# Altium schematic sheet MAIN.SchDoc: HQ_RPI_T113_V04
size 840 x 594 mm; Date: 2024.11.4; DrawnBy: Zegnfh; Page Create Date: March  8, 1995; Date1: 2024.11.4; Page Number: 1; PageTitle: MAIN; Page Size: NC; Comment: Title_ElecLab; Page Count: 1; Designer: Yukiyu; RevCode: A3; DsnPath: F:\share\Embed\HQ_RPI_T113_V04\HQ_RPI_T113_V04_162.DSN; SchematicName: SCHEMATIC1; PageName: MAIN; PageSize: A1; TopSchematic: True
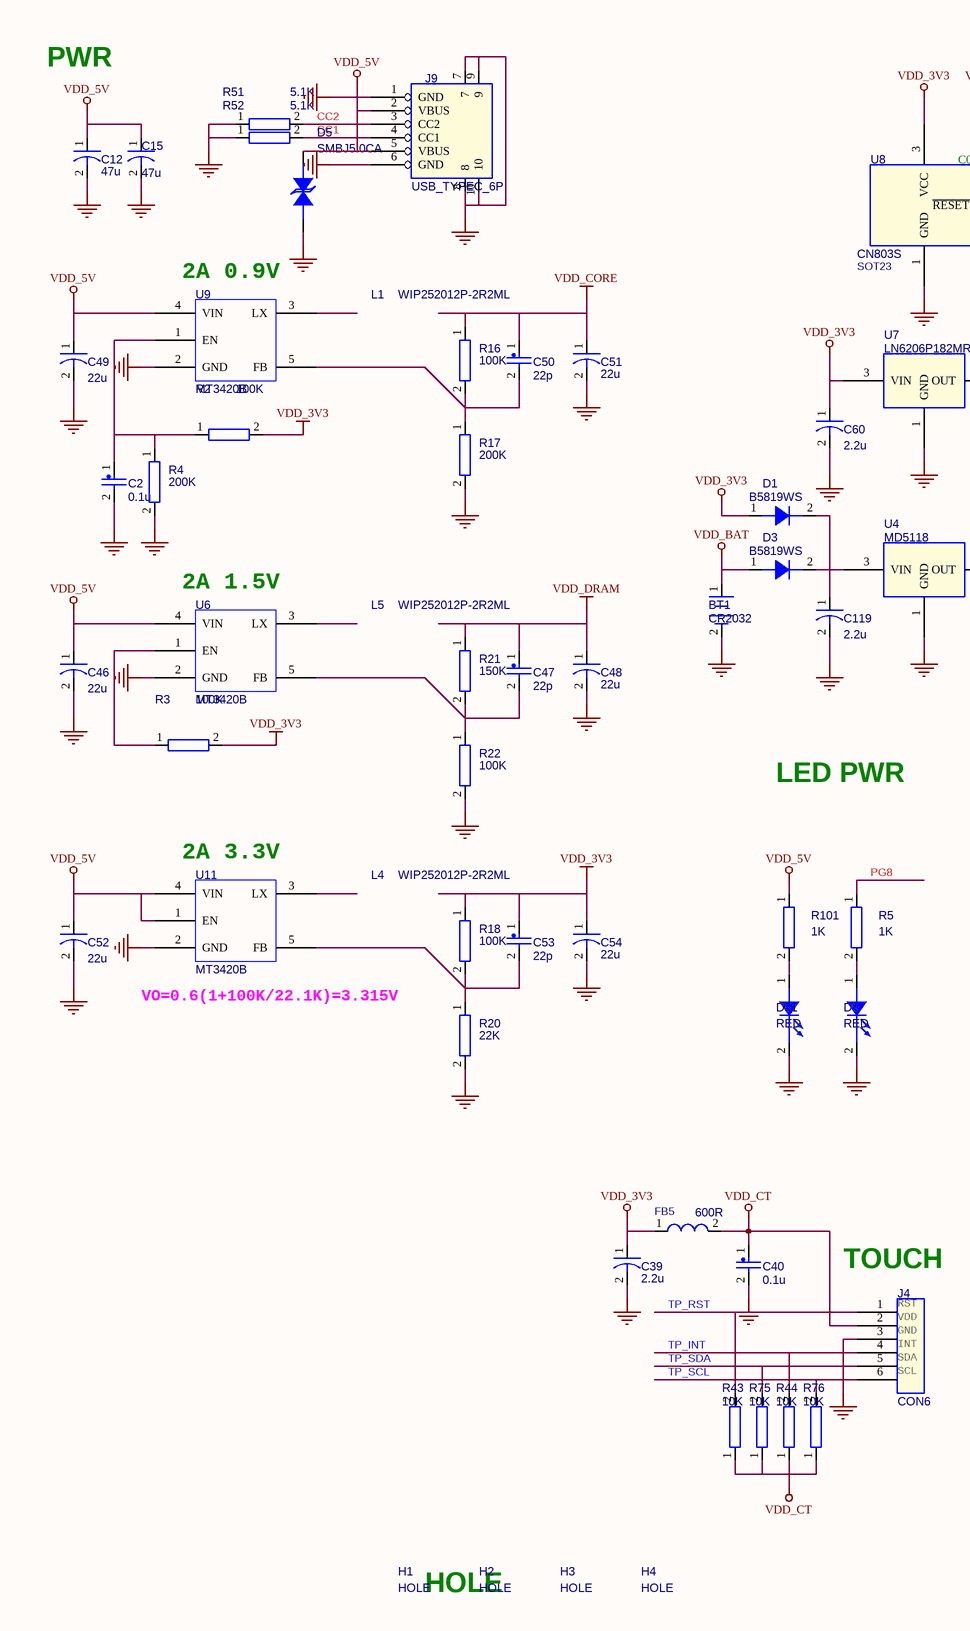
[diagram p0: MAIN.SchDoc, top left]
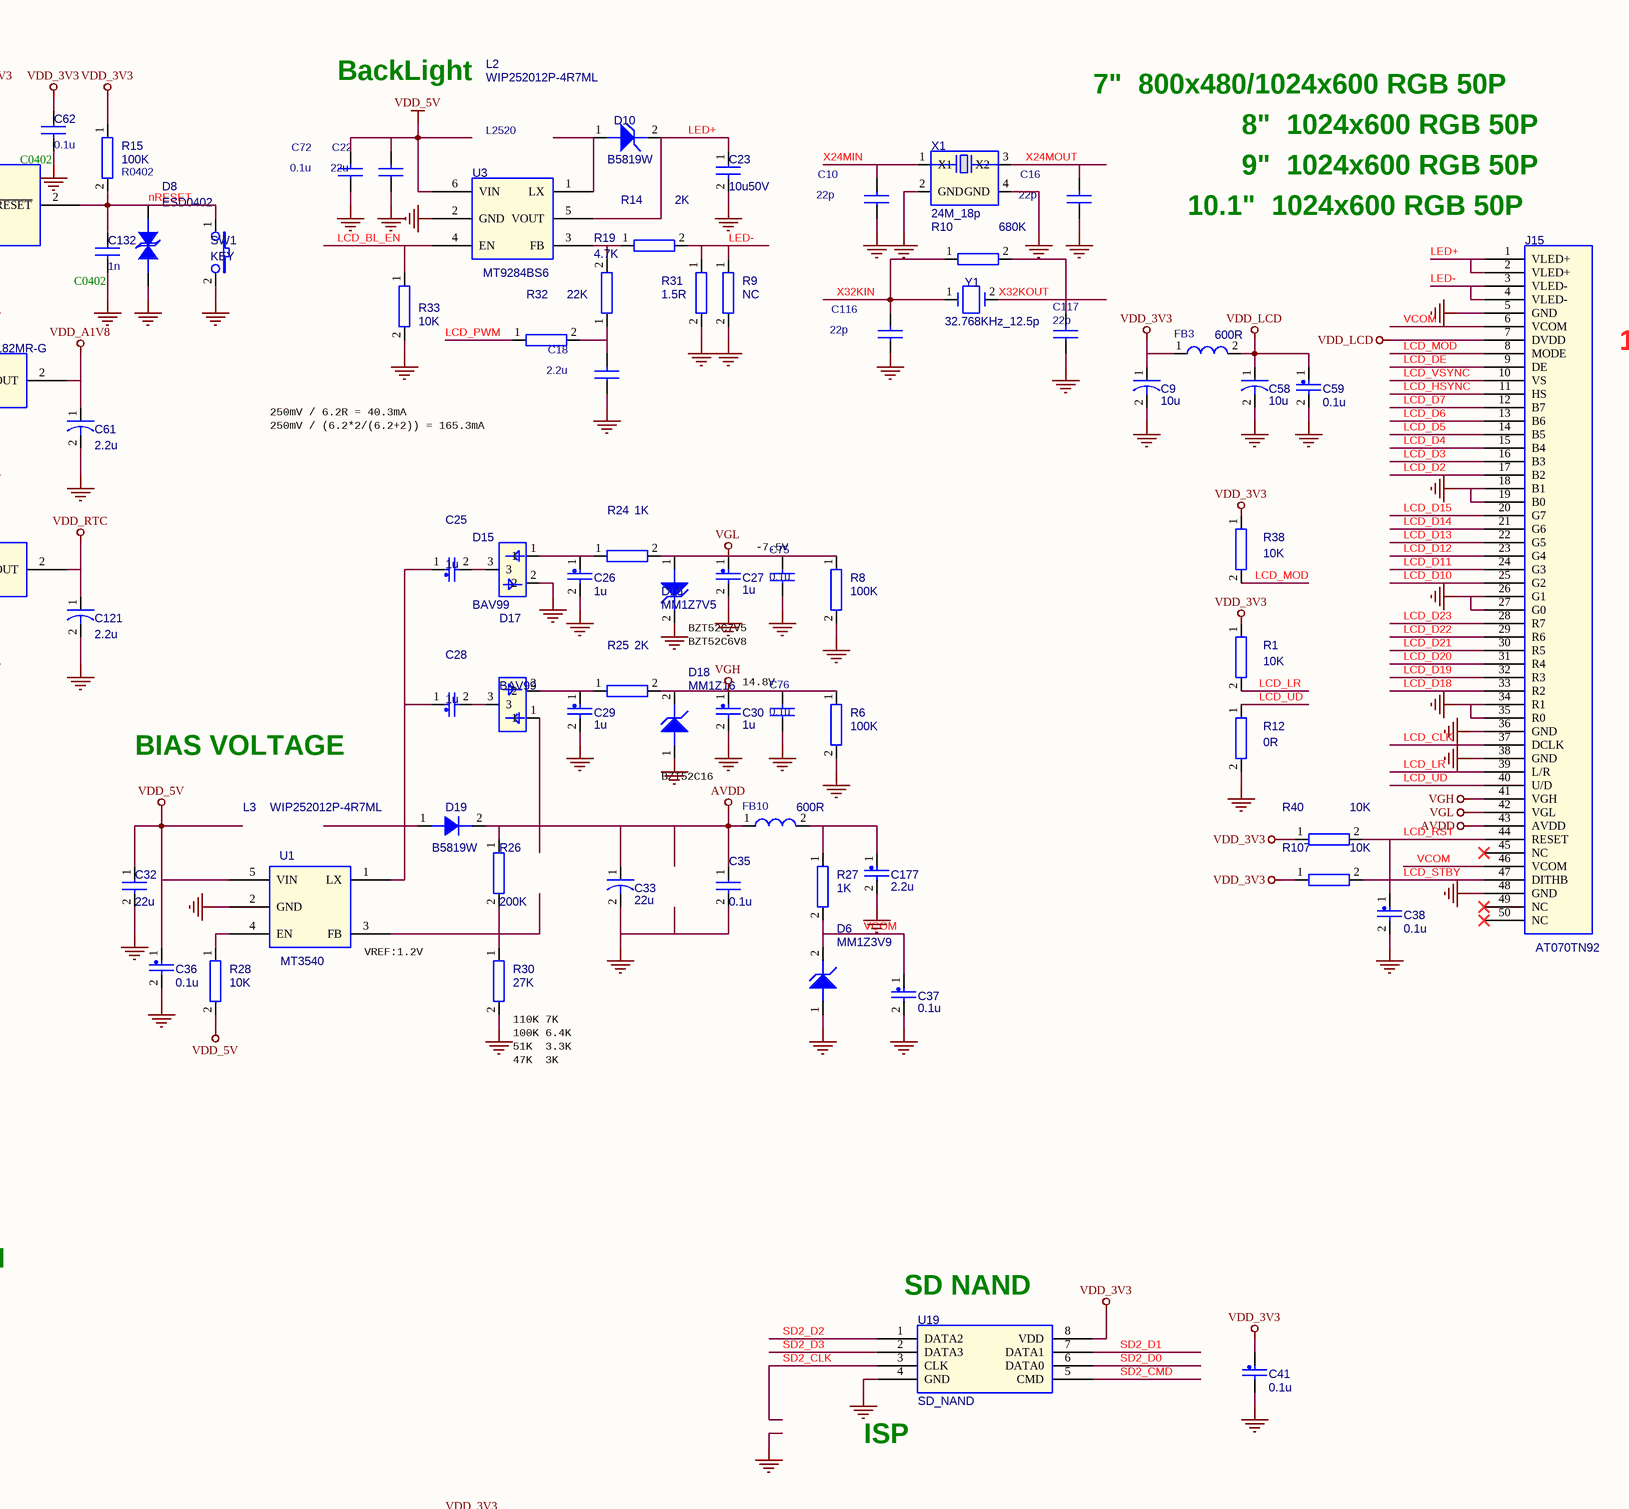
[diagram p1: MAIN.SchDoc, top middle]
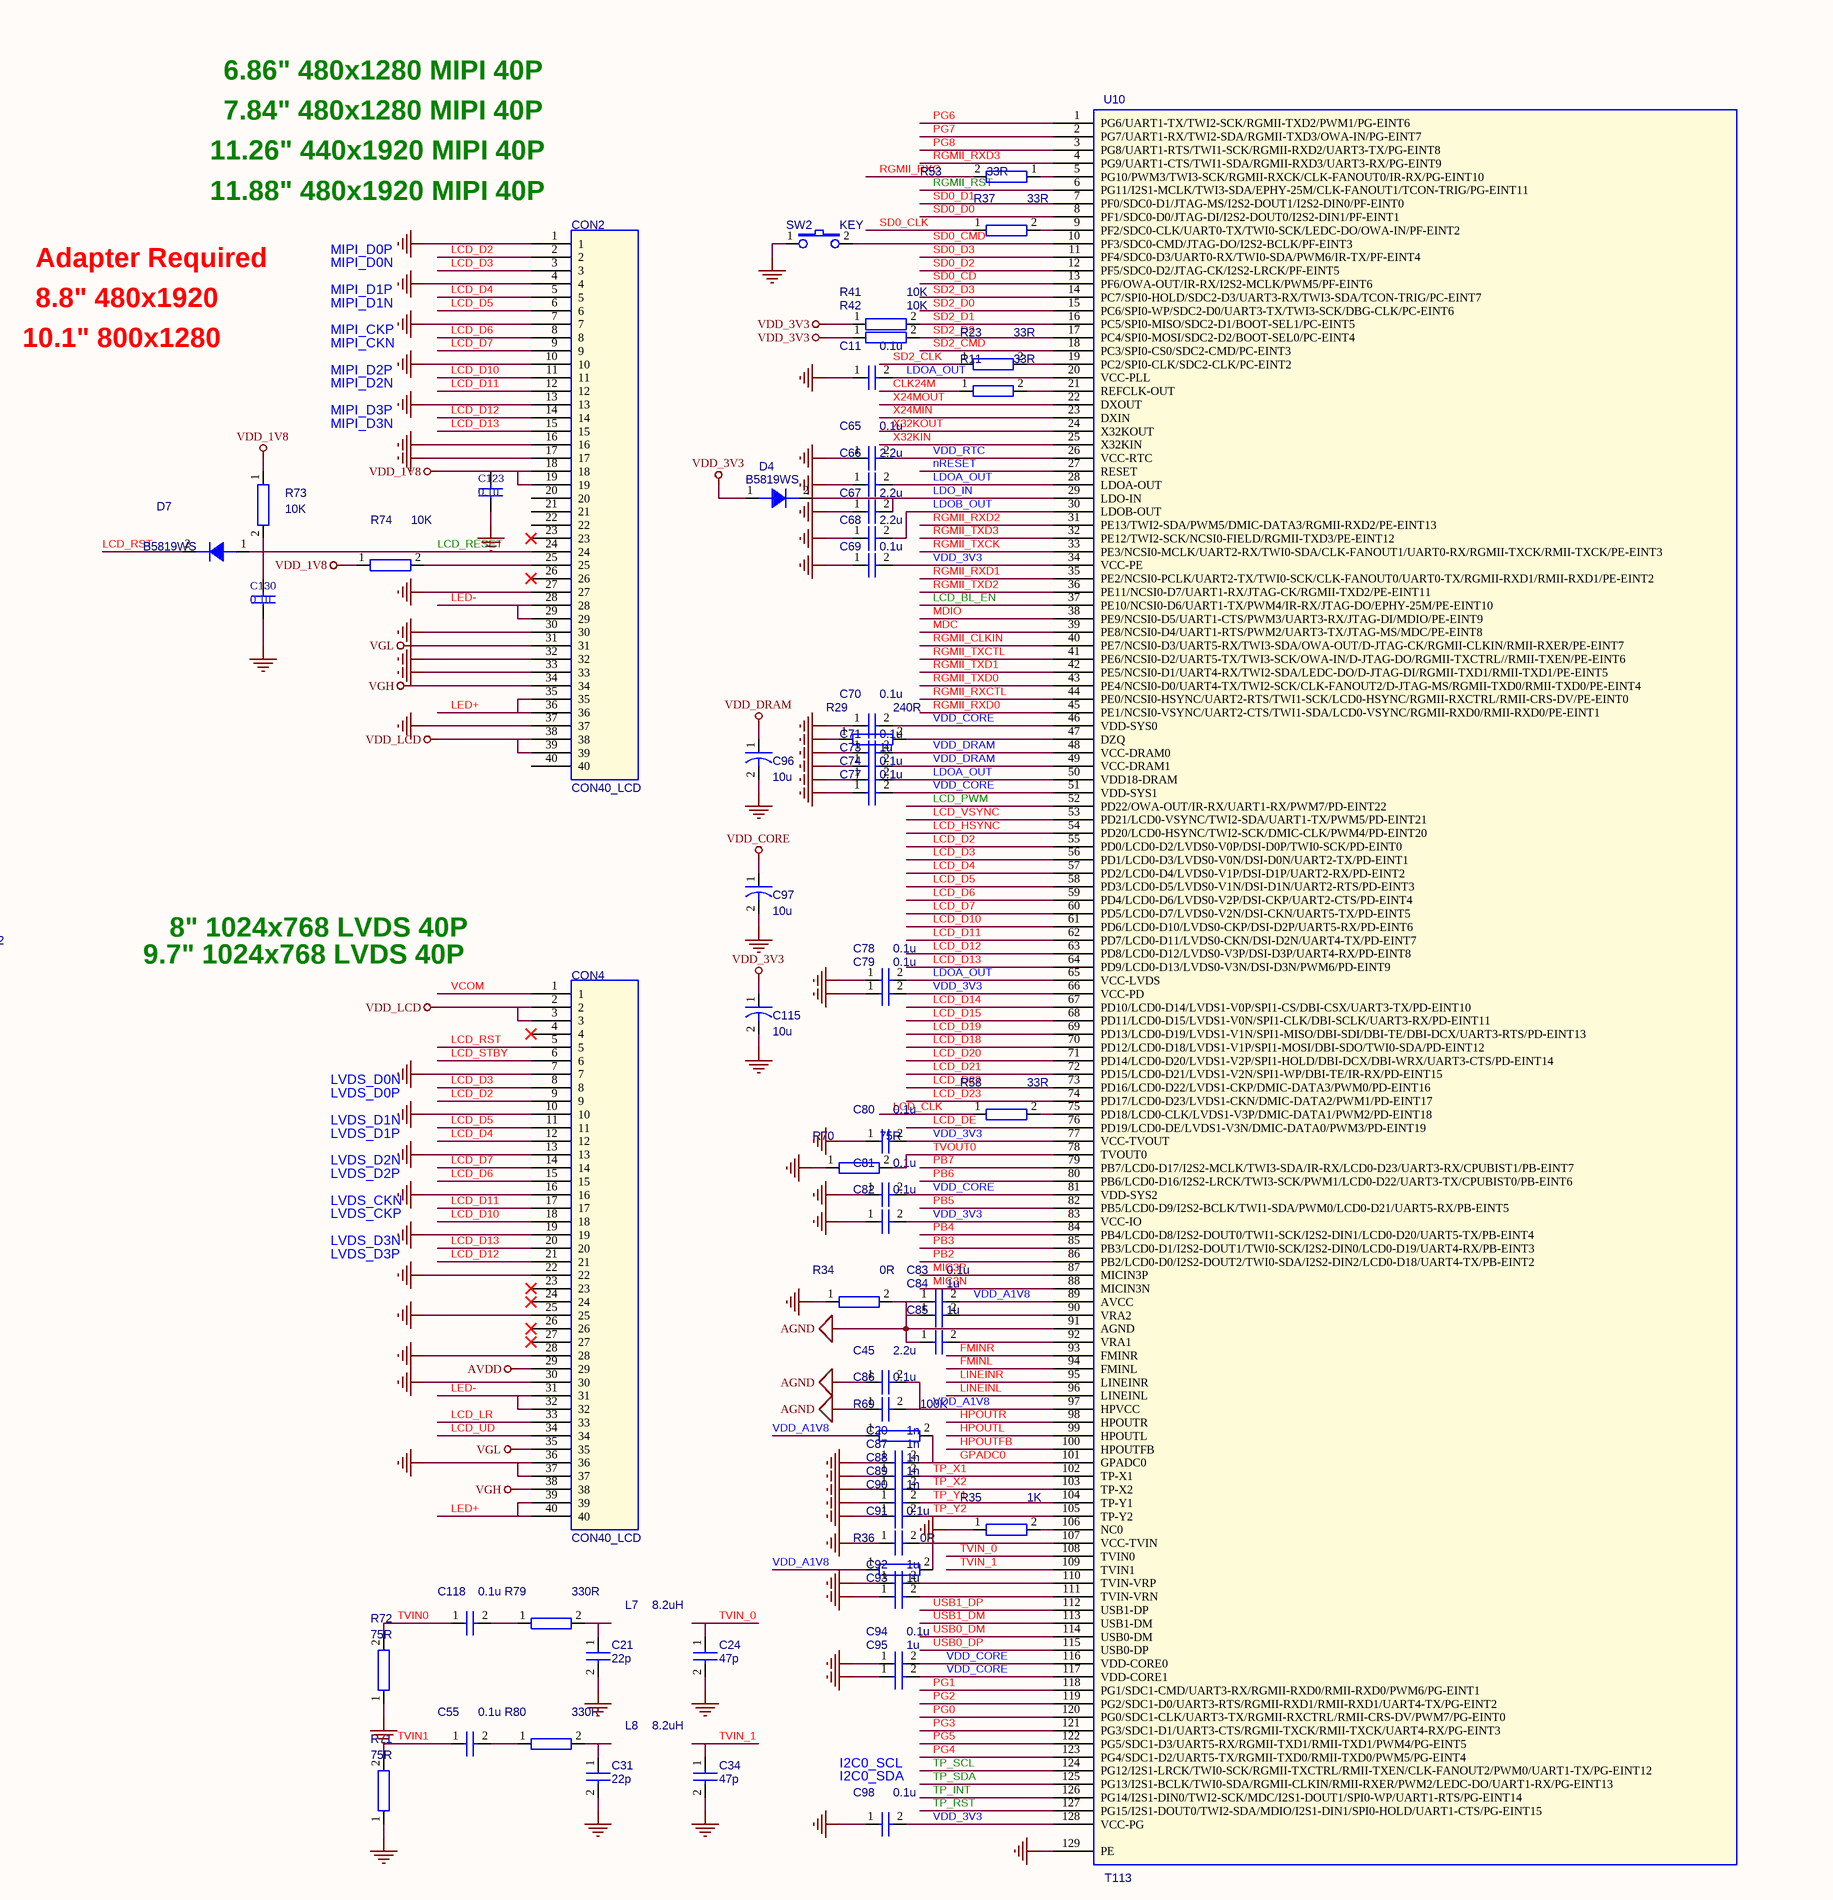
[diagram p2: MAIN.SchDoc, top right]
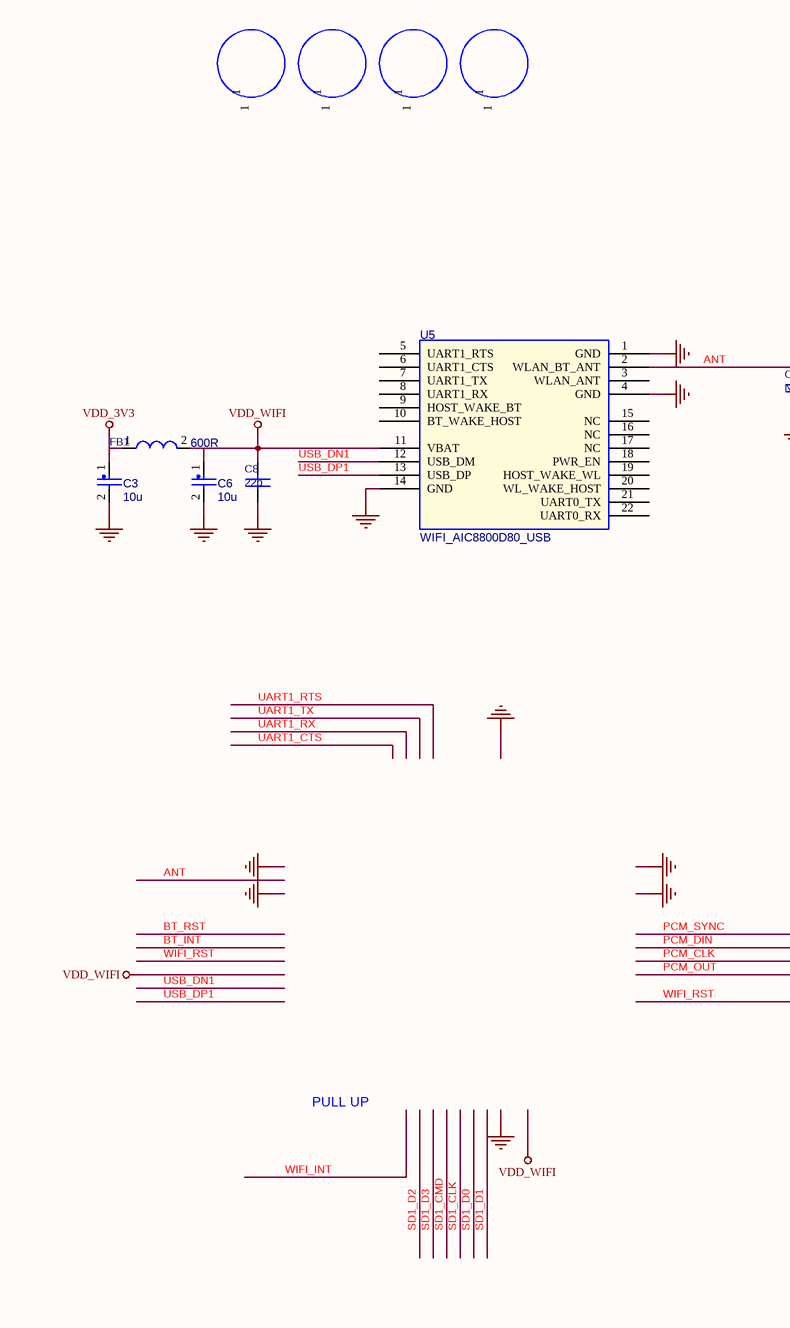
[diagram p3: MAIN.SchDoc, bottom left]
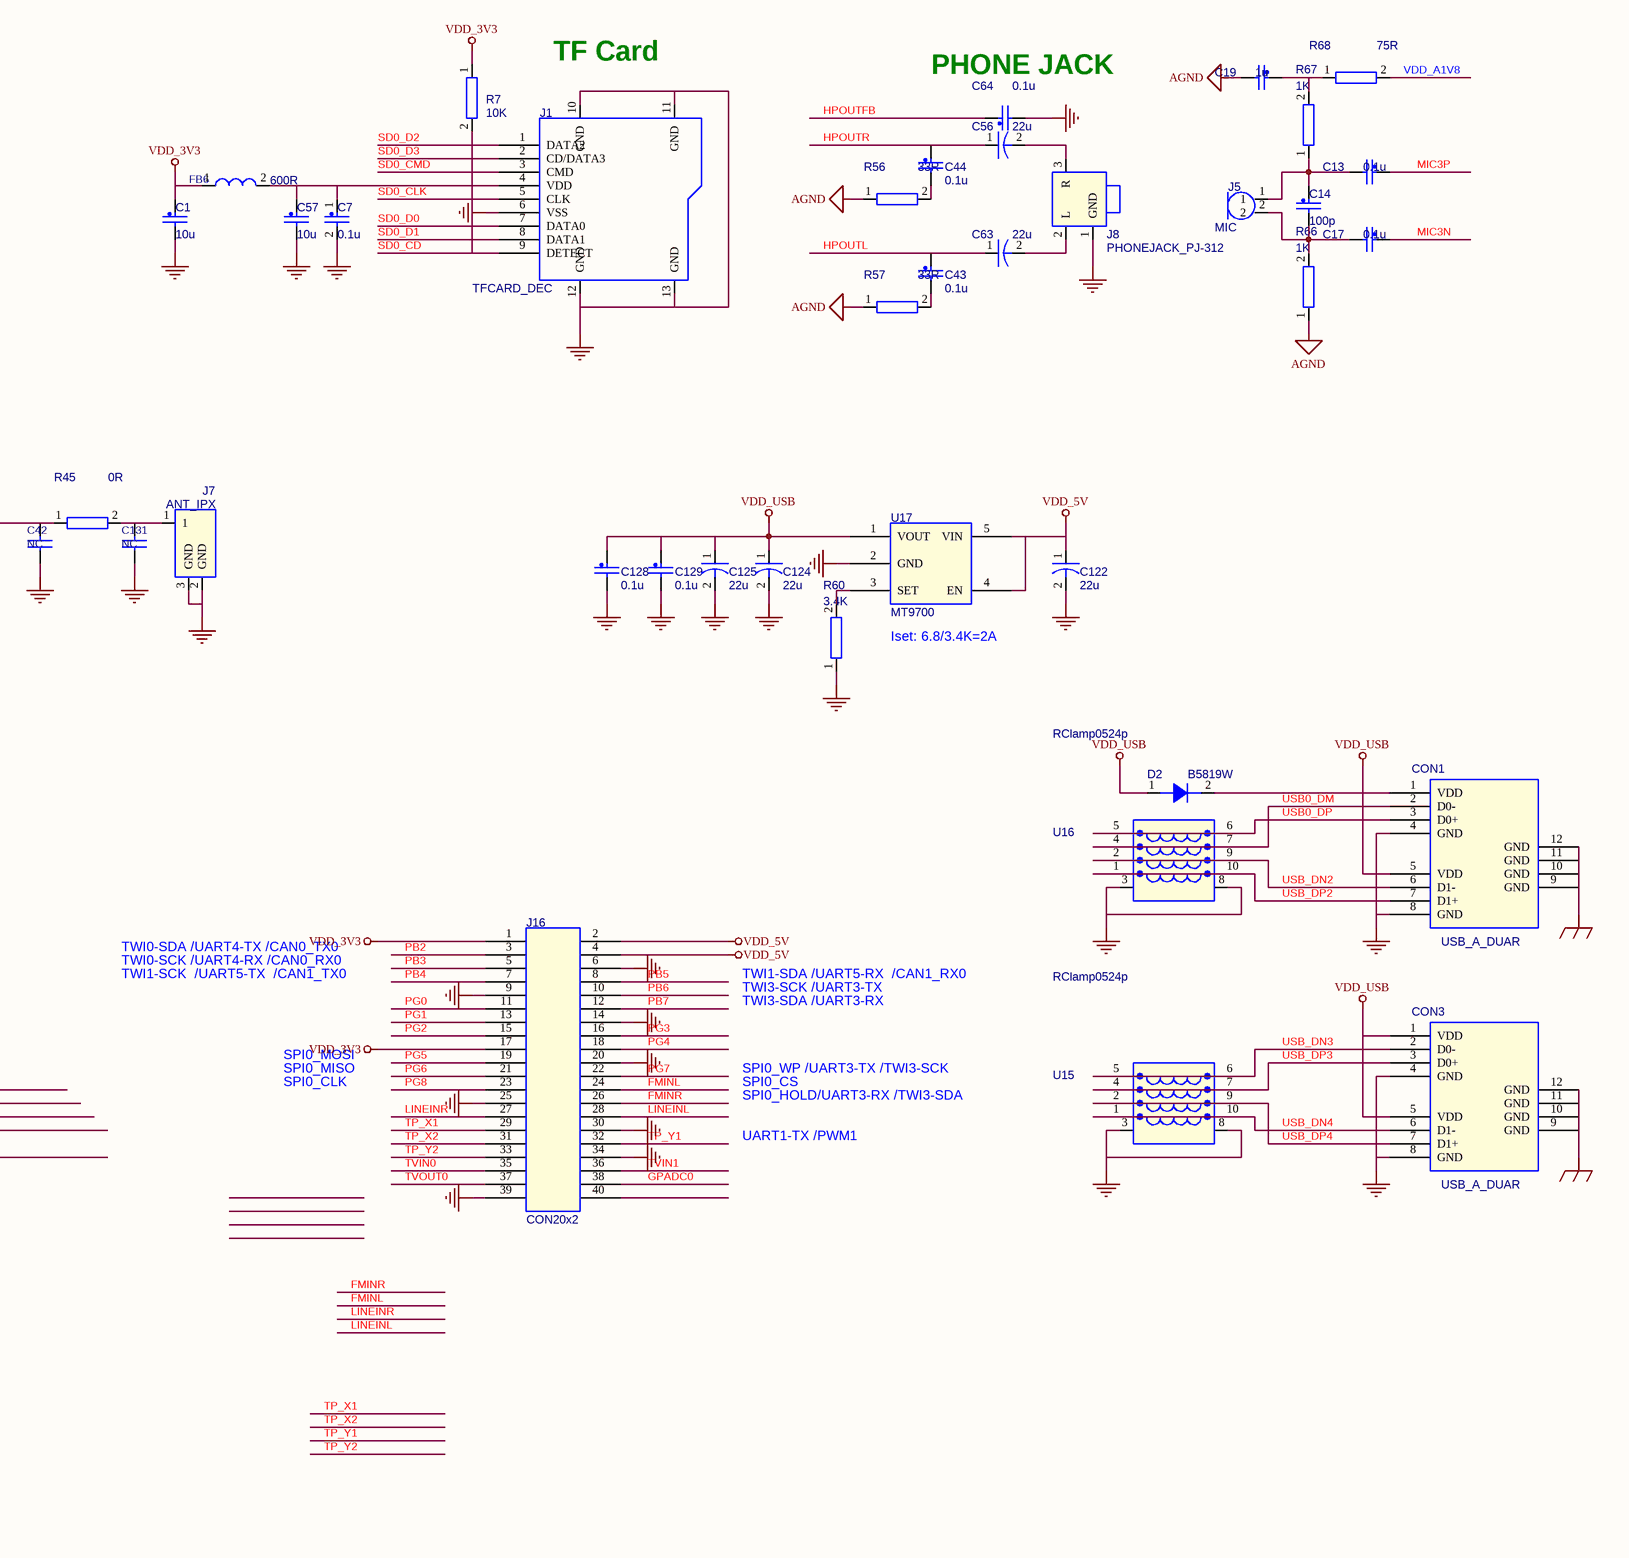
[diagram p4: MAIN.SchDoc, bottom middle]
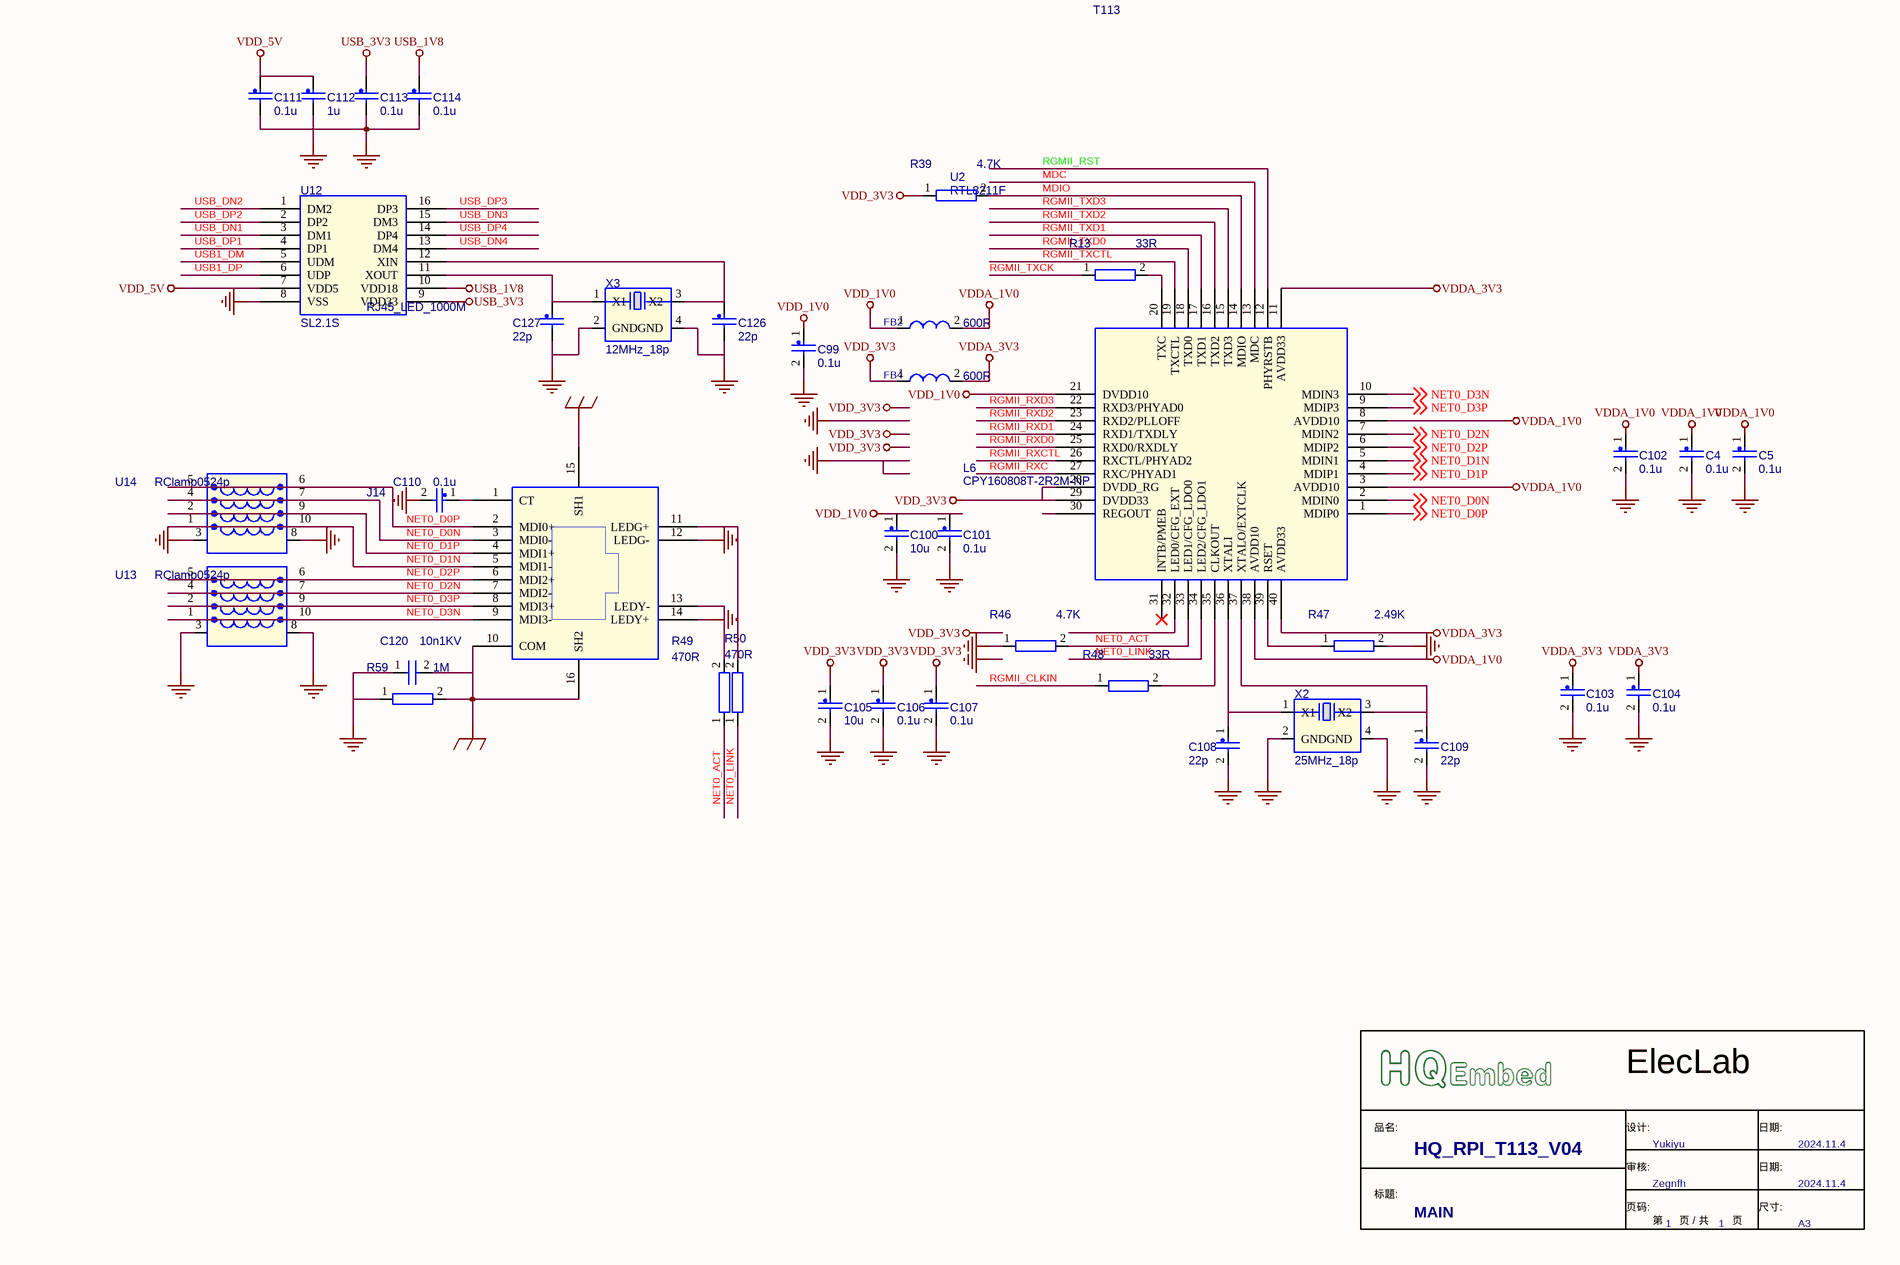
[diagram p5: MAIN.SchDoc, bottom right]

## Parts
*  Date1: 2024.11.4  RevCode: A3  Title: HQ_RPI_T113_V04  Page Number: 1  PageTitle: MAIN  Designer: Yukiyu  DrawnBy: Zegnfh  (hidden comment: Title_ElecLab)  (graphical)
BT1  CR2032  [CON_CR2032]
C1  10u  [C0603]
C2  0.1u  [C0603]
C3  10u  [C0603]
C4  0.1u  [C0603]
C5  0.1u  [C0603]
C6  10u  [C0603]
C7  0.1u  [C0603]
C8  22p  [C0402]
C9  10u  [C1206]
C10  22p  [C0402]
C11  0.1u  [C0603]
C12  47u  [C1206]
C13  0.1u  [C0402]
C14  100p  [C0402]
C15  47u  [C1206]
C16  22p  [C0402]
C17  0.1u  [C0402]
C18  2.2u  [C0402]
C19  1u  [C0402]
C20  1n  [C0603]
C21  22p  [C0603]
C22  22u  [C0805]
C23  10u50V  [C1206]
C24  47p  [C0603]
C25  1u  [C0603]
C26  1u  [C0603]
C27  1u  [C0603]
C28  1u  [C0603]
C29  1u  [C0603]
C30  1u  [C0603]
C31  22p  [C0603]
C32  22u  [C0805]
C33  22u  [C1206]
C34  47p  [C0603]
C35  0.1u  [RC_C0603]
C36  0.1u  [C0603]
C37  0.1u  [C0603]
C38  0.1u  [C0603]
C39  2.2u  [C1206]
C40  0.1u  [C0603]
C41  0.1u  [C0402]
C42  NC  [C0402]
C43  0.1u  [C0402]
C44  0.1u  [C0402]
C45  2.2u  [C0603]
C46  22u  [C1206]
C47  22p  [C0603]
C48  22u  [C1206]
C49  22u  [C1206]
C50  22p  [C0603]
C51  22u  [C1206]
C52  22u  [C1206]
C53  22p  [C0603]
C54  22u  [C1206]
C55  0.1u  [C0603]
C56  22u  [C1206]
C57  10u  [C0603]
C58  10u  [C1206]
C59  0.1u  [C0603]
C60  2.2u  [C1206]
C61  2.2u  [C1206]
C62  0.1u  [C0402]
C63  22u  [C1206]
C64  0.1u  [C0402]
C65  0.1u  [C0603]
C66  2.2u  [C0603]
C67  2.2u  [C0603]
C68  2.2u  [C0603]
C69  0.1u  [C0603]
C70  0.1u  [C0603]
C71  0.1u  [C0603]
C72  0.1u  [C0402]
C73  1u  [C0603]
C74  0.1u  [C0603]
C75  0.1u  [C0402]
C76  0.1u  [C0402]
C77  0.1u  [C0603]
C78  0.1u  [C0603]
C79  0.1u  [C0603]
C80  0.1u  [C0603]
C81  0.1u  [C0603]
C82  0.1u  [C0603]
C83  0.1u  [C0603]
C84  1u  [C0603]
C85  1u  [C0603]
C86  0.1u  [C0603]
C87  1n  [C0603]
C88  1n  [C0603]
C89  1n  [C0603]
C90  1n  [C0603]
C91  0.1u  [C0603]
C92  1u  [C0603]
C93  1u  [C0603]
C94  0.1u  [C0603]
C95  1u  [C0603]
C96  10u  [C1206]
C97  10u  [C1206]
C98  0.1u  [C0603]
C99  0.1u  [C0603]
C100  10u  [C0603]
C101  0.1u  [C0603]
C102  0.1u  [C0603]
C103  0.1u  [C0603]
C104  0.1u  [C0603]
C105  10u  [C0603]
C106  0.1u  [C0603]
C107  0.1u  [C0603]
C108  22p  [C0603]
C109  22p  [C0603]
C110  0.1u  [C0603]
C111  0.1u  [C0402]
C112  1u  [C0402]
C113  0.1u  [C0402]
C114  0.1u  [C0402]
C115  10u  [C1206]
C116  22p  [C0402]
C117  22p  [C0402]
C118  0.1u  [C0603]
C119  2.2u  [C1206]
C120  10n1KV  [C0603]
C121  2.2u  [C1206]
C122  22u  [C1206]
C123  0.1u  [C0402]
C124  22u  [C1206]
C125  22u  [C1206]
C126  22p  [C0402]
C127  22p  [C0402]
C128  0.1u  [C0402]
C129  0.1u  [C0402]
C130  0.1u  [C0402]
C131  NC  [C0402]
C132  1n  [C0402]
C177  2.2u  [C0603]
CON1  USB_A_DUAR  [USB_A_DUAL]
CON2  CON40_LCD  [LCD-FPC-40-0P5-90-REV]
CON3  USB_A_DUAR  [USB_A_DUAL]
CON4  CON40_LCD  [LCD-FPC-40-0P5-90]
D1  B5819WS  [D0805]
D2  B5819W  [DIODE]
D3  B5819WS  [D0805]
D4  B5819WS  [D0805]
D5  SMBJ5.0CA  [SMB]
D6  MM1Z3V9  [SOD123]
D7  B5819WS  [D0805]
D8  ESD0402  [SMB]
D9  RED  [LED0603]
D10  B5819W  [SOD123]
D15  BAV99  [SOT23]
D16  MM1Z7V5  [SOD123]
D17  BAV99  [SOT23]
D18  MM1Z16  [SOD123]
D19  B5819W  [DIODE]
D51  RED  [LED0603]
FB1  600R  [L0805]
FB2  600R  [L0805]
FB3  600R  [L0805]
FB4  600R  [L0805]
FB5  600R  [L0805]
FB6  600R  [L0805]
FB10  600R  [L0805]
H1  HOLE  [HOLE-260/125]
H2  HOLE  [HOLE-260/125]
H3  HOLE  [HOLE-260/125]
H4  HOLE  [HOLE-260/125]
J1  TFCARD_DEC  [TFCARD_DEC]
J4  CON6  [LCD-FPC-6-0P5-90-REV]
J5  MIC  [MIC_01]
J7  ANT_IPX  [ANT_IPX]
J8  PHONEJACK_PJ-312  [PHONEJACK_PJ-312_DIP]
J9  USB_TYPEC_6P  [USB_TYPEC_6P]
J14  RJ45_LED_1000M  [HR911130A]
J15  AT070TN92  [LCD-FPC-50-0P5-90]
J16  CON20x2  [CON20X2.54MM]
L1  WIP252012P-2R2ML  [L4X4]
L2  WIP252012P-4R7ML  PCB Footprint: L2520  [L4X4]
L3  WIP252012P-4R7ML  [L1206]
L4  WIP252012P-2R2ML  [L4X4]
L5  WIP252012P-2R2ML  [L4X4]
L6  CPY160808T-2R2M-NP  [L4X4]
L7  8.2uH  [L4X4]
L8  8.2uH  [L4X4]
R1  10K  [R0603]
R2  100K  [R0603]
R3  100K  [R0603]
R4  200K  [R0603]
R5  1K  [R0603]
R6  100K  [R0603]
R7  10K  [R0402]
R8  100K  [R0603]
R9  NC  [R0603]
R10  680K  [R0603]
R11  33R  [R0603]
R12  0R  [R0603]
R13  33R  [R0603]
R14  2K  [R0603]
R15  100K  PCB Footprint: R0402  [R0603]
R16  100K  [R0603]
R17  200K  [R0603]
R18  100K  [R0603]
R19  4.7K  [R0603]
R20  22K  [R0603]
R21  150K  [R0603]
R22  100K  [R0603]
R23  33R  [R0603]
R24  1K  [R0603]
R25  2K  [R0603]
R26  200K  [R0603]
R27  1K  [R0603]
R28  10K  [R0603]
R29  240R  [R0603]
R30  27K  [R0603]
R31  1.5R  [R0603]
R32  22K  [R0603]
R33  10K  [R0603]
R34  0R  [R0603]
R35  1K  [R0603]
R36  0R  [R0603]
R37  33R  [R0603]
R38  10K  [R0603]
R39  4.7K  [R0603]
R40  10K  [R0603]
R41  10K  [R0603]
R42  10K  [R0603]
R43  10K  [R0603]
R44  10K  [R0603]
R45  0R  [R0603]
R46  4.7K  [R0603]
R47  2.49K  [R0603]
R48  33R  [R0603]
R49  470R  [R0603]
R50  470R  [R0603]
R51  5.1K  [R0603]
R52  5.1K  [R0603]
R53  33R  [R0603]
R56  33R  [R0603]
R57  33R  [R0603]
R58  33R  [R0603]
R59  1M  [R0603]
R60  3.4K  [R0603]
R66  1K  [R0603]
R67  1K  [R0603]
R68  75R  [R0603]
R69  100K  [R0603]
R70  75R  [R0603]
R71  75R  [R0603]
R72  75R  [R0603]
R73  10K  [R0603]
R74  10K  [R0603]
R75  10K  [R0603]
R76  10K  [R0603]
R79  330R  [R0603]
R80  330R  [R0603]
R101  1K  [R0603]
R107  10K  [R0603]
SW1  KEY  [SW6X6]
SW2  KEY  [SW6X6]
U1  MT3540  [SOT23-5]
U2  RTL8211F  [QFN40_GNDPAD]
U3  MT9284BS6  [SOT23-6]
U4  MD5118  [SOT23]
U5  WIFI_AIC8800D80_USB  [WIFI_AIC8800D80_USB]
U6  MT3420B  [SOT23-5]
U7  LN6206P182MR-G  [SOT23]
U8  CN803S  [SOT23]
U9  MT3420B  [SOT23-5]
U10  T113  [LQFP128_0P4_16X16_EP]
U11  MT3420B  [SOT23-5]
U12  SL2.1S  [SSOP16]
U13  RClamp0524p  [SPE6V8UD]
U14  RClamp0524p  [SPE6V8UD]
U15  RClamp0524p  [SPE6V8UD]
U16  RClamp0524p  [SPE6V8UD]
U17  MT9700  [SOT23-5]
U19  SD_NAND  [TF_SMD]
X1  24M_18p  [XTAL_SMD_6035]
X2  25MHz_18p  [XTAL_SMD_6035]
X3  12MHz_18p  [XTAL_SMD_6035]
Y1  32.768KHz_12.5p  [XTAL_3]

## Nets
AGND: C19.2 C45.1 C83.1 C84.1 C85.1 C86.1 R34.2 R56.1 R57.1 R66.1 U10.91(AGND)
AVDD: C33.1 C35.1 CON4.29 D17.1 D19.2(K) FB10.1 J15.43(AVDD) R26.1
GND: BT1.2(-) C1.2 C2.2 C3.2 C4.2 C5.2 C6.2 C7.2 C8.1 C9.2 C10.1 C11.1 C12.2 C15.2 C16.1 C18.1 C20.1 C21.2 C22.1 C23.2 C24.2 C26.2 C27.2 C29.2 C30.2 C31.2 C32.2 C33.2 C34.2 C35.2 C36.2 C37.2 C38.2 C39.2 C40.2 C41.2 C42.1 C46.2 C48.2 C49.2 C51.2 C52.2 C54.2 C57.2 C58.2 C59.2 C60.2 C61.2 C62.2 C64.2 C65.1 C66.1 C67.1 C68.1 C69.1 C70.1 C71.1 C72.1 C73.1 C74.1 C75.1 C76.1 C77.1 C78.1 C79.1 C80.1 C81.1 C82.1 C87.1 C88.1 C89.1 C90.1 C91.1 C92.1 C93.1 C94.1 C95.1 C96.2 C97.2 C98.1 C99.2 C100.2 C101.2 C102.2 C103.2 C104.2 C105.2 C106.2 C107.2 C108.2 C109.2 C110.2 C111.2 C112.2 C113.2 C114.2 C115.2 C116.1 C117.1 C119.2 C120.1 C121.2 C122.2 C123.1 C124.2 C125.2 C126.2 C127.2 C128.2 C129.2 C130.1 C131.1 C132.2 C177.2 CON1.4(GND) CON1.8(GND) CON2.1 CON2.4 CON2.7 CON2.10 CON2.13 CON2.16 CON2.17 CON2.27 CON2.30 CON2.32 CON2.33 CON2.37 CON3.4(GND) CON3.8(GND) CON4.7 CON4.10 CON4.13 CON4.16 CON4.19 CON4.22 CON4.25 CON4.28 CON4.30 CON4.36 CON4.37 D5.1(ANODE) D6.1(ANODE) D8.1(ANODE) D9.2(CATHODE) D15.2 D16.2(CATHODE) D18.1(ANODE) D51.2(CATHODE) J1.6(VSS) J1.10(GND) J1.11(GND) J1.12(GND) J1.13(GND) J4.3 J7.2(GND) J7.3(GND) J8.1(GND) J9.1(GND) J9.6(GND) J9.7 J9.8 J9.9 J9.10 J14.12(LEDG-) J14.14(LEDY+) J15.5(GND) J15.18(B1) J15.19(B0) J15.26(G1) J15.27(G0) J15.34(R1) J15.35(R0) J15.36(GND) J15.38(GND) J15.48(GND) J16.6 J16.9 J16.14 J16.20 J16.25 J16.30 J16.34 J16.39 R4.2 R6.2 R8.2 R9.2 R12.2 R17.2 R20.2 R22.2 R29.1 R30.2 R31.2 R33.2 R34.1 R35.1 R46.1 R47.2 R51.1 R52.1 R59.1 R60.1 R70.1 R71.1 R72.1 SW1.2 SW2.1 U1.2(GND) U3.2(GND) U4.1(GND) U5.1(GND) U5.4(GND) U5.14(GND) U6.2(GND) U7.1(GND) U8.1(GND) U9.2(GND) U10.129(PE) U11.2(GND) U12.8(VSS) U13.3 U13.8 U14.3 U14.8 U15.3 U15.8 U16.3 U16.8 U17.2(GND) U19.4(GND) X1.2(GND) X1.4(GND) X2.2(GND) X2.4(GND) X3.2(GND) X3.4(GND)
GND_EARTH: C120.2 CON1.9(GND) CON1.10(GND) CON1.11(GND) CON1.12(GND) CON3.9(GND) CON3.10(GND) CON3.11(GND) CON3.12(GND) J14.10(COM) J14.15(SH1) J14.16(SH2) R59.2
USB_1V8: C114.1 U12.10(VDD18)
USB_3V3: C113.1 U12.9(VDD33)
VDD_1V0: C99.1 C100.1 C101.1 FB2.1 U2.21(DVDD10)
VDD_1V8: C123.2 CON2.18 CON2.19 R73.1 R74.1
VDD_3V3: C1.1 C3.1 C9.1 C39.1 C41.1 C53.1 C54.1 C60.1 C62.1 C69.2 C79.2 C80.2 C82.2 C98.2 C105.1 C106.1 C107.1 C115.1 D1.1(A) D4.1(A) FB1.1 FB3.1 FB4.1 FB5.1 FB6.1 J16.1 J16.17 R1.1 R2.2 R3.2 R7.1 R15.1 R18.1 R38.1 R39.1 R40.1 R41.1 R42.1 R107.1 U2.28(DVDD_RG) U2.29(DVDD33) U7.3(VIN) U8.3(VCC) U10.34(VCC-PE) U10.66(VCC-PD) U10.77(VCC-TVOUT) U10.83(VCC-IO) U10.128(VCC-PG) U19.8(VDD)
VDD_5V: C12.1 C15.1 C22.2 C32.1 C36.1 C46.1 C49.1 C52.1 C72.2 C111.1 C112.1 C122.1 D5.2(CATHODE) J9.2(VBUS) J9.5(VBUS) J16.2 J16.4 R28.2 R101.1 U1.5(VIN) U3.6(VIN) U6.4(VIN) U9.4(VIN) U11.1(EN) U11.4(VIN) U12.7(VDD5) U17.4(EN) U17.5(VIN)
VDD_A1V8: C45.2 C61.1 C83.2 C86.2 R36.1 R68.2 R69.1 U7.2(OUT) U10.89(AVCC) U10.97(HPVCC)
VDD_BAT: BT1.1(+) D3.1(A)
VDD_CORE: C50.1 C51.1 C70.2 C77.2 C81.2 C94.2 C95.2 C97.1 R16.1 U10.46(VDD-SYS0) U10.51(VDD-SYS1) U10.81(VDD-SYS2) U10.116(VDD-CORE0) U10.117(VDD-CORE1)
VDD_CT: C40.1 FB5.2 J4.2 R43.1 R44.1 R75.1 R76.1
VDD_DRAM: C47.1 C48.1 C71.2 C73.2 C96.1 R21.1 U10.48(VCC-DRAM0) U10.49(VCC-DRAM1)
VDD_LCD: C58.1 C59.1 CON2.38 CON2.39 CON4.2 CON4.3 FB3.2 J15.7(DVDD)
VDD_RTC: C65.2 C121.1 U4.2(OUT) U10.26(VCC-RTC)
VDD_USB: C124.1 C125.1 C128.1 C129.1 CON1.5(VDD) CON3.1(VDD) CON3.5(VDD) D2.1(A) U17.1(VOUT)
VDD_WIFI: C6.1 C8.2 FB1.2 U5.11(VBAT)
VDDA_1V0: C4.1 C5.1 C102.1 FB2.2 U2.3(AVDD10) U2.8(AVDD10) U2.38(AVDD10)
VDDA_3V3: C103.1 C104.1 FB4.2 U2.11(AVDD33) U2.40(AVDD33)
VGH: C30.1 C76.2 CON2.34 CON4.38 D18.2(CATHODE) J15.41(VGH) R6.1 R25.2
VGL: C27.1 C75.2 CON2.31 CON4.35 D16.1(ANODE) J15.42(VGL) R8.1 R24.2
ANT: C42.2 R45.1 U5.2(WLAN_BT_ANT)
CC1: J9.4(CC1) R52.2
CC2: J9.3(CC2) R51.2
CLK24M: R11.1
FMINL: J16.24 U10.94(FMINL)
FMINR: J16.26 U10.93(FMINR)
GPADC0: C20.2 J16.38 R69.2 U10.101(GPADC0)
HPOUTFB: C64.1 U10.100(HPOUTFB)
HPOUTL: C43.1 C63.1 U10.99(HPOUTL)
HPOUTR: C44.1 C56.1 U10.98(HPOUTR)
LCD_BL_EN: R33.1 U3.4(EN) U10.37(PE10/NCSI0-D6/UART1-TX/PWM4/IR-RX/JTAG-DO/EPHY-25M/PE-EINT10)
LCD_CLK: J15.37(DCLK) R58.1
LCD_D2: CON2.2 CON4.9 J15.17(B2) U10.55(PD0/LCD0-D2/LVDS0-V0P/DSI-D0P/TWI0-SCK/PD-EINT0)
LCD_D3: CON2.3 CON4.8 J15.16(B3) U10.56(PD1/LCD0-D3/LVDS0-V0N/DSI-D0N/UART2-TX/PD-EINT1)
LCD_D4: CON2.5 CON4.12 J15.15(B4) U10.57(PD2/LCD0-D4/LVDS0-V1P/DSI-D1P/UART2-RX/PD-EINT2)
LCD_D5: CON2.6 CON4.11 J15.14(B5) U10.58(PD3/LCD0-D5/LVDS0-V1N/DSI-D1N/UART2-RTS/PD-EINT3)
LCD_D6: CON2.8 CON4.15 J15.13(B6) U10.59(PD4/LCD0-D6/LVDS0-V2P/DSI-CKP/UART2-CTS/PD-EINT4)
LCD_D7: CON2.9 CON4.14 J15.12(B7) U10.60(PD5/LCD0-D7/LVDS0-V2N/DSI-CKN/UART5-TX/PD-EINT5)
LCD_D10: CON2.11 CON4.18 J15.25(G2) U10.61(PD6/LCD0-D10/LVDS0-CKP/DSI-D2P/UART5-RX/PD-EINT6)
LCD_D11: CON2.12 CON4.17 J15.24(G3) U10.62(PD7/LCD0-D11/LVDS0-CKN/DSI-D2N/UART4-TX/PD-EINT7)
LCD_D12: CON2.14 CON4.21 J15.23(G4) U10.63(PD8/LCD0-D12/LVDS0-V3P/DSI-D3P/UART4-RX/PD-EINT8)
LCD_D13: CON2.15 CON4.20 J15.22(G5) U10.64(PD9/LCD0-D13/LVDS0-V3N/DSI-D3N/PWM6/PD-EINT9)
LCD_D14: J15.21(G6) U10.67(PD10/LCD0-D14/LVDS1-V0P/SPI1-CS/DBI-CSX/UART3-TX/PD-EINT10)
LCD_D15: J15.20(G7) U10.68(PD11/LCD0-D15/LVDS1-V0N/SPI1-CLK/DBI-SCLK/UART3-RX/PD-EINT11)
LCD_D18: J15.33(R2) U10.70(PD12/LCD0-D18/LVDS1-V1P/SPI1-MOSI/DBI-SDO/TWI0-SDA/PD-EINT12)
LCD_D19: J15.32(R3) U10.69(PD13/LCD0-D19/LVDS1-V1N/SPI1-MISO/DBI-SDI/DBI-TE/DBI-DCX/UART3-RTS/PD-EINT13)
LCD_D20: J15.31(R4) U10.71(PD14/LCD0-D20/LVDS1-V2P/SPI1-HOLD/DBI-DCX/DBI-WRX/UART3-CTS/PD-EINT14)
LCD_D21: J15.30(R5) U10.72(PD15/LCD0-D21/LVDS1-V2N/SPI1-WP/DBI-TE/IR-RX/PD-EINT15)
LCD_D22: J15.29(R6) U10.73(PD16/LCD0-D22/LVDS1-CKP/DMIC-DATA3/PWM0/PD-EINT16)
LCD_D23: J15.28(R7) U10.74(PD17/LCD0-D23/LVDS1-CKN/DMIC-DATA2/PWM1/PD-EINT17)
LCD_DE: J15.9(DE) U10.76(PD19/LCD0-DE/LVDS1-V3N/DMIC-DATA0/PWM3/PD-EINT19)
LCD_HSYNC: J15.11(HS) U10.54(PD20/LCD0-HSYNC/TWI2-SCK/DMIC-CLK/PWM4/PD-EINT20)
LCD_LR: CON4.33 J15.39(L/R) R1.2
LCD_MOD: J15.8(MODE) R38.2
LCD_PWM: R32.1 U10.52(PD22/OWA-OUT/IR-RX/UART1-RX/PWM7/PD-EINT22)
LCD_RESET: C130.2 CON2.24 D7.1(A) R73.2
LCD_RST: C38.1 CON4.5 D7.2(K) J15.44(RESET) R40.2
LCD_STBY: CON4.6 J15.47(DITHB) R107.2
LCD_UD: CON4.34 J15.40(U/D) R12.1
LCD_VSYNC: J15.10(VS) U10.53(PD21/LCD0-VSYNC/TWI2-SDA/UART1-TX/PWM5/PD-EINT21)
LDO_IN: C67.2 D4.2(K) U10.29(LDO-IN)
LDOA_OUT: C11.2 C66.2 C74.2 C78.2 U10.20(VCC-PLL) U10.28(LDOA-OUT) U10.50(VDD18-DRAM) U10.65(VCC-LVDS)
LDOB_OUT: C68.2 U10.30(LDOB-OUT)
LED+: C23.1 CON2.35 CON2.36 CON4.39 CON4.40 D10.2(CATHODE) J15.1(VLED+) J15.2(VLED+) U3.5(VOUT)
LED-: CON2.28 CON2.29 CON4.31 CON4.32 J15.3(VLED-) J15.4(VLED-) R9.1 R14.2 R31.1
LINEINL: J16.28 U10.96(LINEINL)
LINEINR: J16.27 U10.95(LINEINR)
MDC: U2.13(MDC) U10.39(PE8/NCSI0-D4/UART1-RTS/PWM2/UART3-TX/JTAG-MS/MDC/PE-EINT8)
MDIO: R39.2 U2.14(MDIO) U10.38(PE9/NCSI0-D5/UART1-CTS/PWM3/UART3-RX/JTAG-DI/MDIO/PE-EINT9)
MIC3N: C17.1 U10.88(MICIN3N)
MIC3P: C13.1 U10.87(MICIN3P)
NET0_ACT: R46.2 R49.1 U2.33(LED1/CFG_LDO0)
NET0_D0N: J14.3(MDI0-) U2.2(MDIN0) U14.4 U14.7 ; off-sheet NET0_D0N
NET0_D0P: J14.2(MDI0+) U2.1(MDIP0) U14.5 U14.6 ; off-sheet NET0_D0P
NET0_D1N: J14.5(MDI1-) U2.5(MDIN1) U14.1 U14.10 ; off-sheet NET0_D1N
NET0_D1P: J14.4(MDI1+) U2.4(MDIP1) U14.2 U14.9 ; off-sheet NET0_D1P
NET0_D2N: J14.7(MDI2-) U2.7(MDIN2) U13.4 U13.7 ; off-sheet NET0_D2N
NET0_D2P: J14.6(MDI2+) U2.6(MDIP2) U13.5 U13.6 ; off-sheet NET0_D2P
NET0_D3N: J14.9(MDI3-) U2.10(MDIN3) U13.1 U13.10 ; off-sheet NET0_D3N
NET0_D3P: J14.8(MDI3+) U2.9(MDIP3) U13.2 U13.9 ; off-sheet NET0_D3P
NET0_LINK: R50.1 U2.34(LED2/CFG_LDO1)
nRESET: C132.1 D8.2(CATHODE) R15.2 SW1.1 U8.2(~{RESET}) U10.27(RESET)
PB2: J16.3 U10.86(PB2/LCD0-D0/I2S2-DOUT2/TWI0-SDA/I2S2-DIN2/LCD0-D18/UART4-TX/PB-EINT2)
PB3: J16.5 U10.85(PB3/LCD0-D1/I2S2-DOUT1/TWI0-SCK/I2S2-DIN0/LCD0-D19/UART4-RX/PB-EINT3)
PB4: J16.7 U10.84(PB4/LCD0-D8/I2S2-DOUT0/TWI1-SCK/I2S2-DIN1/LCD0-D20/UART5-TX/PB-EINT4)
PB5: J16.8 U10.82(PB5/LCD0-D9/I2S2-BCLK/TWI1-SDA/PWM0/LCD0-D21/UART5-RX/PB-EINT5)
PB6: J16.10 U10.80(PB6/LCD0-D16/I2S2-LRCK/TWI3-SCK/PWM1/LCD0-D22/UART3-TX/CPUBIST0/PB-EINT6)
PB7: J16.12 U10.79(PB7/LCD0-D17/I2S2-MCLK/TWI3-SDA/IR-RX/LCD0-D23/UART3-RX/CPUBIST1/PB-EINT7)
PG0: J16.11 U10.120(PG0/SDC1-CLK/UART3-TX/RGMII-RXCTRL/RMII-CRS-DV/PWM7/PG-EINT0)
PG1: J16.13 U10.118(PG1/SDC1-CMD/UART3-RX/RGMII-RXD0/RMII-RXD0/PWM6/PG-EINT1)
PG2: J16.15 U10.119(PG2/SDC1-D0/UART3-RTS/RGMII-RXD1/RMII-RXD1/UART4-TX/PG-EINT2)
PG3: J16.16 U10.121(PG3/SDC1-D1/UART3-CTS/RGMII-TXCK/RMII-TXCK/UART4-RX/PG-EINT3)
PG4: J16.18 U10.123(PG4/SDC1-D2/UART5-TX/RGMII-TXD0/RMII-TXD0/PWM5/PG-EINT4)
PG5: J16.19 U10.122(PG5/SDC1-D3/UART5-RX/RGMII-TXD1/RMII-TXD1/PWM4/PG-EINT5)
PG6: J16.21 U10.1(PG6/UART1-TX/TWI2-SCK/RGMII-TXD2/PWM1/PG-EINT6)
PG7: J16.22 U10.2(PG7/UART1-RX/TWI2-SDA/RGMII-TXD3/OWA-IN/PG-EINT7)
PG8: J16.23 R5.1 U10.3(PG8/UART1-RTS/TWI1-SCK/RGMII-RXD2/UART3-TX/PG-EINT8)
RGMII_CLKIN: R48.1 U10.40(PE7/NCSI0-D3/UART5-RX/TWI3-SDA/OWA-OUT/D-JTAG-CK/RGMII-CLKIN/RMII-RXER/PE-EINT7)
RGMII_RST: U2.12(PHYRSTB) U10.6(PG11/I2S1-MCLK/TWI3-SDA/EPHY-25M/CLK-FANOUT1/TCON-TRIG/PG-EINT11)
RGMII_RXC: R53.2 U2.27(RXC/PHYAD1)
RGMII_RXCTL: U2.26(RXCTL/PHYAD2) U10.44(PE0/NCSI0-HSYNC/UART2-RTS/TWI1-SCK/LCD0-HSYNC/RGMII-RXCTRL/RMII-CRS-DV/PE-EINT0)
RGMII_RXD0: U2.25(RXD0/RXDLY) U10.45(PE1/NCSI0-VSYNC/UART2-CTS/TWI1-SDA/LCD0-VSYNC/RGMII-RXD0/RMII-RXD0/PE-EINT1)
RGMII_RXD1: U2.24(RXD1/TXDLY) U10.35(PE2/NCSI0-PCLK/UART2-TX/TWI0-SCK/CLK-FANOUT0/UART0-TX/RGMII-RXD1/RMII-RXD1/PE-EINT2)
RGMII_RXD2: U2.23(RXD2/PLLOFF) U10.31(PE13/TWI2-SDA/PWM5/DMIC-DATA3/RGMII-RXD2/PE-EINT13)
RGMII_RXD3: U2.22(RXD3/PHYAD0) U10.4(PG9/UART1-CTS/TWI1-SDA/RGMII-RXD3/UART3-RX/PG-EINT9)
RGMII_TXCK: R13.1 U10.33(PE3/NCSI0-MCLK/UART2-RX/TWI0-SDA/CLK-FANOUT1/UART0-RX/RGMII-TXCK/RMII-TXCK/PE-EINT3)
RGMII_TXCTL: U2.19(TXCTL) U10.41(PE6/NCSI0-D2/UART5-TX/TWI3-SCK/OWA-IN/D-JTAG-DO/RGMII-TXCTRL//RMII-TXEN/PE-EINT6)
RGMII_TXD0: U2.18(TXD0) U10.43(PE4/NCSI0-D0/UART4-TX/TWI2-SCK/CLK-FANOUT2/D-JTAG-MS/RGMII-TXD0/RMII-TXD0/PE-EINT4)
RGMII_TXD1: U2.17(TXD1) U10.42(PE5/NCSI0-D1/UART4-RX/TWI2-SDA/LEDC-DO/D-JTAG-DI/RGMII-TXD1/RMII-TXD1/PE-EINT5)
RGMII_TXD2: U2.16(TXD2) U10.36(PE11/NCSI0-D7/UART1-RX/JTAG-CK/RGMII-TXD2/PE-EINT11)
RGMII_TXD3: U2.15(TXD3) U10.32(PE12/TWI2-SCK/NCSI0-FIELD/RGMII-TXD3/PE-EINT12)
SD0_CD: J1.9(DETECT) R7.2 U10.13(PF6/OWA-OUT/IR-RX/I2S2-MCLK/PWM5/PF-EINT6)
SD0_CLK: J1.5(CLK) R37.1
SD0_CMD: J1.3(CMD) SW2.2 U10.10(PF3/SDC0-CMD/JTAG-DO/I2S2-BCLK/PF-EINT3)
SD0_D0: J1.7(DATA0) U10.8(PF1/SDC0-D0/JTAG-DI/I2S2-DOUT0/I2S2-DIN1/PF-EINT1)
SD0_D1: J1.8(DATA1) U10.7(PF0/SDC0-D1/JTAG-MS/I2S2-DOUT1/I2S2-DIN0/PF-EINT0)
SD0_D2: J1.1(DATA2) U10.12(PF5/SDC0-D2/JTAG-CK/I2S2-LRCK/PF-EINT5)
SD0_D3: J1.2(CD/DATA3) U10.11(PF4/SDC0-D3/UART0-RX/TWI0-SDA/PWM6/IR-TX/PF-EINT4)
SD2_CLK: R23.1 U19.3(CLK)
SD2_CMD: U10.18(PC3/SPI0-CS0/SDC2-CMD/PC-EINT3) U19.5(CMD)
SD2_D0: U10.15(PC6/SPI0-WP/SDC2-D0/UART3-TX/TWI3-SCK/DBG-CLK/PC-EINT6) U19.6(DATA0)
SD2_D1: R41.2 U10.16(PC5/SPI0-MISO/SDC2-D1/BOOT-SEL1/PC-EINT5) U19.7(DATA1)
SD2_D2: R42.2 U10.17(PC4/SPI0-MOSI/SDC2-D2/BOOT-SEL0/PC-EINT4) U19.1(DATA2)
SD2_D3: U10.14(PC7/SPI0-HOLD/SDC2-D3/UART3-RX/TWI3-SDA/TCON-TRIG/PC-EINT7) U19.2(DATA3)
TP_INT: J4.4 R44.2 U10.126(PG14/I2S1-DIN0/TWI2-SCK/MDC/I2S1-DOUT1/SPI0-WP/UART1-RTS/PG-EINT14)
TP_RST: J4.1 R43.2 U10.127(PG15/I2S1-DOUT0/TWI2-SDA/MDIO/I2S1-DIN1/SPI0-HOLD/UART1-CTS/PG-EINT15)
TP_SCL: J4.6 R76.2 U10.124(PG12/I2S1-LRCK/TWI0-SCK/RGMII-TXCTRL/RMII-TXEN/CLK-FANOUT2/PWM0/UART1-TX/PG-EINT12)
TP_SDA: J4.5 R75.2 U10.125(PG13/I2S1-BCLK/TWI0-SDA/RGMII-CLKIN/RMII-RXER/PWM2/LEDC-DO/UART1-RX/PG-EINT13)
TP_X1: C87.2 J16.29 U10.102(TP-X1)
TP_X2: C88.2 J16.31 U10.103(TP-X2)
TP_Y1: C89.2 J16.32 U10.104(TP-Y1)
TP_Y2: C90.2 J16.33 U10.105(TP-Y2)
TVIN0: C118.1 J16.35 R72.2
TVIN1: C55.1 J16.36 R71.2
TVIN_0: C24.1 U10.108(TVIN0)
TVIN_1: C34.1 U10.109(TVIN1)
TVOUT0: J16.37 R70.2 U10.78(TVOUT0)
USB0_DM: CON1.2(D0-) U10.114(USB0-DM) U16.4 U16.7
USB0_DP: CON1.3(D0+) U10.115(USB0-DP) U16.5 U16.6
USB1_DM: U10.113(USB1-DM) U12.5(UDM)
USB1_DP: U10.112(USB1-DP) U12.6(UDP)
USB_DN1: U5.12(USB_DM) U12.3(DM1)
USB_DN2: CON1.6(D1-) U12.1(DM2) U16.2 U16.9
USB_DN3: CON3.2(D0-) U12.15(DM3) U15.5 U15.6
USB_DN4: CON3.6(D1-) U12.13(DM4) U15.1 U15.10
USB_DP1: U5.13(USB_DP) U12.4(DP1)
USB_DP2: CON1.7(D1+) U12.2(DP2) U16.1 U16.10
USB_DP3: CON3.3(D0+) U12.16(DP3) U15.4 U15.7
USB_DP4: CON3.7(D1+) U12.14(DP4) U15.2 U15.9
VCOM: C37.1 CON4.1 D6.2(CATHODE) J15.6(VCOM) J15.46(VCOM) R27.2
X24MIN: C10.2 U10.23(DXIN) X1.1(X1)
X24MOUT: C16.2 U10.22(DXOUT) X1.3(X2)
X32KIN: C116.2 R10.1 U10.25(X32KIN) Y1.1
X32KOUT: C117.2 R10.2 U10.24(X32KOUT) Y1.2
NetC2_1: C2.1 R2.1 R4.1 U9.1(EN)
NetC7_1: C7.1 C57.1 FB6.2 J1.4(VDD)
NetC13_2: C13.2 C14.1 J5.1 R67.1
NetC14_2: C14.2 C17.2 J5.2 R66.2
NetC18_2: C18.2 R19.1 R32.2
NetC19_1: C19.1 R67.2 R68.1
NetC21_1: C21.1 R79.2
NetC25_1: C25.1 C28.1 D19.1(A) U1.1(LX)
NetC25_2: C25.2 D15.3
NetC26_1: C26.1 D15.1 R24.1
NetC28_2: C28.2 D17.3
NetC29_1: C29.1 D17.2 R25.1
NetC31_1: C31.1 R80.2
NetC43_2: C43.2 R57.2
NetC44_2: C44.2 R56.2
NetC47_2: C47.2 R21.2 R22.1 U6.5(FB)
NetC50_2: C50.2 R16.2 R17.1 U9.5(FB)
NetC53_2: C53.2 R18.2 R20.1 U11.5(FB)
NetC55_2: C55.2 R80.1
NetC56_2: C56.2 J8.3(R)
NetC63_2: C63.2 J8.2(L)
NetC84_2: C84.2 U10.90(VRA2)
NetC85_2: C85.2 U10.92(VRA1)
NetC91_2: C91.2 R36.2 U10.107(VCC-TVIN)
NetC92_2: C92.2 U10.110(TVIN-VRP)
NetC93_2: C93.2 U10.111(TVIN-VRN)
NetC108_1: C108.1 U2.36(XTALI) X2.1(X1)
NetC109_1: C109.1 U2.37(XTALO/EXTCLK) X2.3(X2)
NetC110_1: C110.1 J14.1(CT)
NetC118_2: C118.2 R79.1
NetC119_1: C119.1 D1.2(K) D3.2(K) U4.3(VIN)
NetC126_1: C126.1 U12.12(XIN) X3.3(X2)
NetC127_1: C127.1 U12.11(XOUT) X3.1(X1)
NetC131_2: C131.2 J7.1 R45.2
NetC177_1: C177.1 FB10.2 R27.1
NetCON1_1: CON1.1(VDD) D2.2(K)
NetCON2_25: CON2.25 R74.2
NetD9_1: D9.1(ANODE) R5.2
NetD10_1: D10.1(ANODE) U3.1(LX)
NetD51_1: D51.1(ANODE) R101.2
NetJ14_11: J14.11(LEDG+) R50.2
NetJ14_13: J14.13(LEDY-) R49.2
NetR3_1: R3.1 U6.1(EN)
NetR11_2: R11.2 U10.21(REFCLK-OUT)
NetR13_2: R13.2 U2.20(TXC)
NetR14_1: R14.1 R19.2 U3.3(FB)
NetR23_2: R23.2 U10.19(PC2/SPI0-CLK/SDC2-CLK/PC-EINT2)
NetR26_2: R26.2 R30.1 U1.3(FB)
NetR28_1: R28.1 U1.4(EN)
NetR29_2: R29.2 U10.47(DZQ)
NetR35_2: R35.2 U10.106(NC0)
NetR37_2: R37.2 U10.9(PF2/SDC0-CLK/UART0-TX/TWI0-SCK/LEDC-DO/OWA-IN/PF-EINT2)
NetR47_1: R47.1 U2.39(RSET)
NetR48_2: R48.2 U2.35(CLKOUT)
NetR53_1: R53.1 U10.5(PG10/PWM3/TWI3-SCK/RGMII-RXCK/CLK-FANOUT0/IR-RX/PG-EINT10)
NetR58_2: R58.2 U10.75(PD18/LCD0-CLK/LVDS1-V3P/DMIC-DATA1/PWM2/PD-EINT18)
NetR60_2: R60.2 U17.3(SET)

Not connected (* = marked no-connect by the designer): CON2 20 21 22 23* 26* 40; CON4 4* 23* 24* 26* 27*; H1 1; H2 1; H3 1; H4 1; J15 45(NC)* 49(NC)* 50(NC)*; J16 40; U2 30(REGOUT) 31(INTB/PMEB)* 32(LED0/CFG_EXT); U5 3(WLAN_ANT) 5(UART1_RTS) 6(UART1_CTS) 7(UART1_TX) 8(UART1_RX) 9(HOST_WAKE_BT) 10(BT_WAKE_HOST) 15(NC) 16(NC) 17(NC) 18(PWR_EN) 19(HOST_WAKE_WL) 20(WL_WAKE_HOST) 21(UART0_TX) 22(UART0_RX); U6 3(LX); U9 3(LX); U11 3(LX)

## Notes on the sheet
- PWR
- BackLight
- 7"  800x480/1024x600 RGB 50P
- 8"  1024x600 RGB 50P
- 6.86" 480x1280 MIPI 40P
- 7.84" 480x1280 MIPI 40P
- 9"  1024x600 RGB 50P
- 11.26" 440x1920 MIPI 40P
- (near CON2) 11.88" 480x1920 MIPI 40P
- (near J15) 10.1"  1024x600 RGB 50P
- Adapter Required
- MIPI_D0P
- MIPI_D0N
- (near U9) 2A 0.9V
- 8.8" 480x1920
- MIPI_D1N
- MIPI_D1P
- MIPI_CKP
- 10.1" 800x1280
- MIPI_CKN
- MIPI_D2P
- MIPI_D2N
- 250mV / 6.2R = 40.3mA
- 250mV / (6.2*2/(6.2+2)) = 165.3mA
- MIPI_D3P
- MIPI_D3N
- (near U6) 2A 1.5V
- (near C75) -7.5V
- (near D16) BZT52C7V5
- (near D16) BZT52C6V8
- 14.8V
- LED PWR
- (near L3) BIAS VOLTAGE
- (near D18) BZT52C16
- (near U11) 2A 3.3V
- 8" 1024x768 LVDS 40P
- (near U11) VO=0.6(1+100K/22.1K)=3.315V
- (near U1) VREF:1.2V
- 9.7" 1024x768 LVDS 40P
- (near R30) 110K 7K
- (near R30) 100K 6.4K
- (near R30) 51K  3.3K
- 47K  3K
- LVDS_D0N
- LVDS_D0P
- LVDS_D1N
- LVDS_D1P
- LVDS_D2P
- LVDS_D2N
- LVDS_CKN
- (near J4) TOUCH
- LVDS_CKP
- LVDS_D3N
- LVDS_D3P
- (near J4) INT
- (near J4) RST
- (near J4) VDD
- (near J4) GND
- (near U19) SD NAND
- (near J4) SDA
- (near J4) SCL
- (near U19) ISP
- (near J1) TF Card
- (near C64) PHONE JACK
- HOLE
- I2C0_SCL
- (near C98) I2C0_SDA
- Iset: 6.8/3.4K=2A
- TWI0-SDA /UART4-TX /CAN0_TX0
- TWI1-SCK  /UART5-TX  /CAN1_TX0
- TWI0-SCK /UART4-RX /CAN0_RX0
- TWI1-SDA /UART5-RX  /CAN1_RX0
- TWI3-SDA /UART3-RX
- TWI3-SCK /UART3-TX
- SPI0_CLK
- SPI0_MOSI
- SPI0_MISO
- SPI0_CS
- SPI0_WP /UART3-TX /TWI3-SCK
- SPI0_HOLD/UART3-RX /TWI3-SDA
- UART1-TX /PWM1
- PULL UP
- (in symbol Title_ElecLab) ElecLab; 品名:; 设计:; 日期:; 审核:; 标题:; 页码:; 尺寸:; 第; 页 / 共; 页

## Library data of the parts
* = Title_ElecLab: Page Size: NC; Date: 2024.11.4; Page Create Date: March  8, 1995; Page Count: 1
BT1 = BATTERY: Part Reference: BT1; PCB Footprint: J2-1.27-90_SMD; Value: CR2032
C1 = CAP_NP: CAP CER 1.0UF 25V 10% X5R 0603; Part Reference: C1; CLASS: DISCRETE; FPLIST: CC0603_OV,CC0603,0603_CC; CAD_APPROVED: Yes; MFG_PN01: C0603C105K3PAC; MFG_NAME01: Kemet; AGILE_PN: 150-78563; Value: 10u; PCB Footprint: C0603; HEIGHT: 0.95MM; ROHS: Yes
C2 = CAP_NP_Dup2: Part Reference: C2; CLASS: DISCRETE; PCB Footprint: C0402; Value: 0.1u
C3 = CAP_NP_Dup1: Part Reference: C3; CLASS: DISCRETE; Value: 10u; PCB Footprint: C0603
C4 = CAP_NP_Dup1: Part Reference: C4; CLASS: DISCRETE; PCB Footprint: C0402; Value: 0.1u
C5 = CAP_NP_Dup1: Part Reference: C5; CLASS: DISCRETE; PCB Footprint: C0402; Value: 0.1u
C6 = CAP_NP_Dup1: Part Reference: C6; CLASS: DISCRETE; Value: 10u; PCB Footprint: C0603
C7 = CAP_NP_Dup2: Part Reference: C7; CLASS: DISCRETE; PCB Footprint: C0402; Value: 0.1u
C8 = CAP NP_Dup3: Part Reference: C8; 1ST PART DESCRIPTION: CAP 10uF X7R 16V 20%; OriginalSymbolOrigin: (0,0); Pin Numbers Visible: False; Pin Names Rotate: True; Value: 22p; PCB Footprint: C0402; Pin Names Visible: False
C9 = C_Dup1: Part Reference: C9; PCB Footprint: C0603; Value: 10u
C10 = CAP NP_Dup3: Part Reference: C10; 1ST PART DESCRIPTION: CAP 10uF X7R 16V 20%; OriginalSymbolOrigin: (0,0); Pin Numbers Visible: False; Pin Names Rotate: True; Value: 22p; Pin Names Visible: False; PCB Footprint: C0402
C11 = CAP NP: Part Reference: C11; PCB Footprint: C0402; Value: 0.1u
C12 = C: Part Reference: C12; Value: 47u; PCB Footprint: C1206
C13 = CAP_NP: CAP CER 0.01UF 10V 10% X5R 0201; Part Reference: C13; CLASS: DISCRETE; AGILE_PN: 150-76650; MFG_NAME01: PANASONIC; MFG_PN01: ECJ-ZEB1A103K; CAD_APPROVED: Yes; FPLIST: CC0201,CC0201_HD,0201_CC; Value: 0.1u; Tolerance: 10%; TOL: 10%; ROHS: Yes; HEIGHT: 0.33mm; PCB Footprint: C0402
C14 = CAP_NP: CAP CER 0.01UF 10V 10% X5R 0201; Part Reference: C14; CLASS: DISCRETE; FPLIST: CC0201,CC0201_HD,0201_CC; CAD_APPROVED: Yes; MFG_PN01: ECJ-ZEB1A103K; MFG_NAME01: PANASONIC; AGILE_PN: 150-76650; Value: 100p; HEIGHT: 0.33mm; ROHS: Yes; TOL: 10%; Tolerance: 10%; PCB Footprint: C0402
C15 = C: Part Reference: C15; Value: 47u; PCB Footprint: C1206
C16 = CAP NP_Dup3: Part Reference: C16; 1ST PART DESCRIPTION: CAP 10uF X7R 16V 20%; OriginalSymbolOrigin: (0,0); Pin Numbers Visible: False; Pin Names Rotate: True; Value: 22p; Pin Names Visible: False; PCB Footprint: C0402
C17 = CAP_NP: CAP CER 0.01UF 10V 10% X5R 0201; Part Reference: C17; CLASS: DISCRETE; FPLIST: CC0201,CC0201_HD,0201_CC; CAD_APPROVED: Yes; MFG_PN01: ECJ-ZEB1A103K; MFG_NAME01: PANASONIC; AGILE_PN: 150-76650; Value: 0.1u; HEIGHT: 0.33mm; ROHS: Yes; TOL: 10%; Tolerance: 10%; PCB Footprint: C0402
C18 = CAP NP_Dup3: Part Reference: C18; 1ST PART DESCRIPTION: CAP 10uF X7R 16V 20%; OriginalSymbolOrigin: (0,0); Pin Numbers Visible: False; Pin Names Rotate: True; Value: 2.2u; Pin Names Visible: False; PCB Footprint: C0402
C19 = CAP_NP: CAP CER 0.01UF 10V 10% X5R 0201; Part Reference: C19; CLASS: DISCRETE; FPLIST: CC0201,CC0201_HD,0201_CC; CAD_APPROVED: Yes; MFG_PN01: ECJ-ZEB1A103K; MFG_NAME01: PANASONIC; AGILE_PN: 150-76650; Value: 1u; HEIGHT: 0.33mm; ROHS: Yes; TOL: 10%; Tolerance: 10%; PCB Footprint: C0402
C20 = CAP NP: Part Reference: C20; PCB Footprint: C0402; Value: 1n
C21 = CAP NP: Part Reference: C21; PCB Footprint: C0402; Value: 22p
C22 = CAP NP_Dup3: Part Reference: C22; 1ST PART DESCRIPTION: CAP 10uF X7R 16V 20%; OriginalSymbolOrigin: (0,0); Pin Names Rotate: True; Pin Names Visible: False; Value: 22u; PCB Footprint: C0805; Pin Numbers Visible: False
C23 = CAP-B: Part Reference: C23; Value: 10u50V; Package: 0603; PCB Footprint: C1206
C24 = CAP NP: Part Reference: C24; PCB Footprint: C0402; Value: 47p
C25 = CAP NP_3: Part Reference: C25; CLASS: DISCRETE; PCB Footprint: C0402; Value: 1u
C26 = CAP NP_3: Part Reference: C26; CLASS: DISCRETE; PCB Footprint: C0402; Value: 1u
C27 = CAP NP_3: Part Reference: C27; CLASS: DISCRETE; PCB Footprint: C0402; Value: 1u
C28 = CAP NP_3: Part Reference: C28; CLASS: DISCRETE; PCB Footprint: C0402; Value: 1u
C29 = CAP NP_3: Part Reference: C29; CLASS: DISCRETE; PCB Footprint: C0402; Value: 1u
C30 = CAP NP_3: Part Reference: C30; CLASS: DISCRETE; PCB Footprint: C0402; Value: 1u
C31 = CAP NP: Part Reference: C31; PCB Footprint: C0402; Value: 22p
C32 = CAP-B: Part Reference: C32; Value: 22u; PCB Footprint: C0805; Package: 0603
C33 = C_Dup1: Part Reference: C33; PCB Footprint: C0805; Value: 22u
C34 = CAP NP: Part Reference: C34; PCB Footprint: C0402; Value: 47p
C35 = CAP NP_Dup2: Part Reference: C35; PCB Footprint: C0402; Value: 0.1u
C36 = CAP NP_3: Part Reference: C36; CLASS: DISCRETE; PCB Footprint: C0402; Value: 0.1u
C37 = CAP NP_3: Part Reference: C37; CLASS: DISCRETE; PCB Footprint: C0402; Value: 0.1u
C38 = CAP NP_3: Part Reference: C38; CLASS: DISCRETE; PCB Footprint: C0402; Value: 0.1u
C39 = C_Dup1: Part Reference: C39; PCB Footprint: C0402; Value: 2.2u
C40 = CAP_NP_Dup2: Part Reference: C40; CLASS: DISCRETE; PCB Footprint: C0402; Value: 0.1u
C41 = CAP_NP: CAP CER 0.01UF 10V 10% X5R 0201; Part Reference: C41; CLASS: DISCRETE; AGILE_PN: 150-76650; MFG_NAME01: PANASONIC; MFG_PN01: ECJ-ZEB1A103K; CAD_APPROVED: Yes; FPLIST: CC0201,CC0201_HD,0201_CC; Value: 0.1u; Tolerance: 10%; TOL: 10%; ROHS: Yes; HEIGHT: 0.33mm; PCB Footprint: C0402
C42 = CAP NP_Dup3: Part Reference: C42; 1ST PART DESCRIPTION: CAP 10uF X7R 16V 20%; OriginalSymbolOrigin: (0,0); Pin Numbers Visible: False; Pin Names Rotate: True; Value: NC; PCB Footprint: C0402; Pin Names Visible: False
C43 = CAP_NP: CAP CER 0.01UF 10V 10% X5R 0201; Part Reference: C43; CLASS: DISCRETE; AGILE_PN: 150-76650; MFG_NAME01: PANASONIC; MFG_PN01: ECJ-ZEB1A103K; CAD_APPROVED: Yes; FPLIST: CC0201,CC0201_HD,0201_CC; Value: 0.1u; PCB Footprint: C0402; Tolerance: 10%; TOL: 10%; ROHS: Yes; HEIGHT: 0.33mm
C44 = CAP_NP: CAP CER 0.01UF 10V 10% X5R 0201; Part Reference: C44; CLASS: DISCRETE; AGILE_PN: 150-76650; MFG_NAME01: PANASONIC; MFG_PN01: ECJ-ZEB1A103K; CAD_APPROVED: Yes; FPLIST: CC0201,CC0201_HD,0201_CC; Value: 0.1u; Tolerance: 10%; TOL: 10%; ROHS: Yes; HEIGHT: 0.33mm; PCB Footprint: C0402
C45 = CAP NP: Part Reference: C45; PCB Footprint: C0402; Value: 2.2u
C46 = C_Dup1: Part Reference: C46; PCB Footprint: C0603; Value: 22u
C47 = CAP_NP_Dup2: Part Reference: C47; CLASS: DISCRETE; PCB Footprint: C0402; Value: 22p
C48 = C_Dup1: Part Reference: C48; PCB Footprint: C0603; Value: 22u
C49 = C_Dup1: Part Reference: C49; PCB Footprint: C0603; Value: 22u
C50 = CAP_NP_Dup2: Part Reference: C50; CLASS: DISCRETE; PCB Footprint: C0402; Value: 22p
C51 = C_Dup1: Part Reference: C51; PCB Footprint: C0603; Value: 22u
C52 = C_Dup1: Part Reference: C52; PCB Footprint: C0603; Value: 22u
C53 = CAP_NP_Dup2: Part Reference: C53; CLASS: DISCRETE; PCB Footprint: C0402; Value: 22p
C54 = C_Dup1: Part Reference: C54; PCB Footprint: C0603; Value: 22u
C55 = CAP NP: Part Reference: C55; PCB Footprint: C0402; Value: 0.1u
C56 = C_Dup1: Part Reference: C56; PCB Footprint: C0805; Value: 22u
C57 = CAP_NP: CAP CER 1.0UF 25V 10% X5R 0603; Part Reference: C57; CLASS: DISCRETE; FPLIST: CC0603_OV,CC0603,0603_CC; CAD_APPROVED: Yes; MFG_PN01: C0603C105K3PAC; MFG_NAME01: Kemet; AGILE_PN: 150-78563; Value: 10u; PCB Footprint: C0603; HEIGHT: 0.95MM; ROHS: Yes
C58 = C_Dup1: Part Reference: C58; PCB Footprint: C0603; Value: 10u
C59 = CAP_NP_Dup2: Part Reference: C59; CLASS: DISCRETE; PCB Footprint: C0402; Value: 0.1u
C60 = C_Dup1: Part Reference: C60; PCB Footprint: C0402; Value: 2.2u
C61 = C_Dup1: Part Reference: C61; PCB Footprint: C0402; Value: 2.2u
C62 = CAP NP_Dup1: Part Reference: C62; Assembly: C0603; Value: 0.1u; PCB Footprint: C0402
C63 = C_Dup1: Part Reference: C63; PCB Footprint: C0805; Value: 22u
C64 = CAP_NP: CAP CER 0.01UF 10V 10% X5R 0201; Part Reference: C64; CLASS: DISCRETE; AGILE_PN: 150-76650; MFG_NAME01: PANASONIC; MFG_PN01: ECJ-ZEB1A103K; CAD_APPROVED: Yes; FPLIST: CC0201,CC0201_HD,0201_CC; Value: 0.1u; PCB Footprint: C0402; Tolerance: 10%; TOL: 10%; ROHS: Yes; HEIGHT: 0.33mm
C65 = CAP NP: Part Reference: C65; PCB Footprint: C0402; Value: 0.1u
C66 = CAP NP: Part Reference: C66; PCB Footprint: C0402; Value: 2.2u
C67 = CAP NP: Part Reference: C67; PCB Footprint: C0402; Value: 2.2u
C68 = CAP NP: Part Reference: C68; PCB Footprint: C0402; Value: 2.2u
C69 = CAP NP: Part Reference: C69; PCB Footprint: C0402; Value: 0.1u
C70 = CAP NP: Part Reference: C70; PCB Footprint: C0402; Value: 0.1u
C71 = CAP NP: Part Reference: C71; PCB Footprint: C0402; Value: 0.1u
C72 = CAP NP_Dup3: Part Reference: C72; 1ST PART DESCRIPTION: CAP 10uF X7R 16V 20%; OriginalSymbolOrigin: (0,0); Pin Names Rotate: TRUE; Pin Names Visible: False; Value: 0.1u; Pin Numbers Visible: False; PCB Footprint: C0402
C73 = CAP NP: Part Reference: C73; PCB Footprint: C0402; Value: 1u
C74 = CAP NP: Part Reference: C74; PCB Footprint: C0402; Value: 0.1u
C75 = CAP NP_Dup3: Part Reference: C75; 1ST PART DESCRIPTION: CAP 10uF X7R 16V 20%; OriginalSymbolOrigin: (0,0); Pin Names Rotate: TRUE; Pin Names Visible: False; Value: 0.1u; Pin Numbers Visible: False; PCB Footprint: C0402
C76 = CAP NP_Dup3: Part Reference: C76; 1ST PART DESCRIPTION: CAP 10uF X7R 16V 20%; OriginalSymbolOrigin: (0,0); Pin Names Rotate: TRUE; Pin Names Visible: False; Value: 0.1u; Pin Numbers Visible: False; PCB Footprint: C0402
C77 = CAP NP: Part Reference: C77; PCB Footprint: C0402; Value: 0.1u
C78 = CAP NP: Part Reference: C78; PCB Footprint: C0402; Value: 0.1u
C79 = CAP NP: Part Reference: C79; PCB Footprint: C0402; Value: 0.1u
C80 = CAP NP: Part Reference: C80; PCB Footprint: C0402; Value: 0.1u
C81 = CAP NP: Part Reference: C81; PCB Footprint: C0402; Value: 0.1u
C82 = CAP NP: Part Reference: C82; PCB Footprint: C0402; Value: 0.1u
C83 = CAP NP: Part Reference: C83; PCB Footprint: C0402; Value: 0.1u
C84 = CAP NP: Part Reference: C84; PCB Footprint: C0402; Value: 1u
C85 = CAP NP: Part Reference: C85; PCB Footprint: C0402; Value: 1u
C86 = CAP NP: Part Reference: C86; PCB Footprint: C0402; Value: 0.1u
C87 = CAP NP: Part Reference: C87; PCB Footprint: C0402; Value: 1n
C88 = CAP NP: Part Reference: C88; PCB Footprint: C0402; Value: 1n
C89 = CAP NP: Part Reference: C89; PCB Footprint: C0402; Value: 1n
C90 = CAP NP: Part Reference: C90; PCB Footprint: C0402; Value: 1n
C91 = CAP NP: Part Reference: C91; PCB Footprint: C0402; Value: 0.1u
C92 = CAP NP: Part Reference: C92; PCB Footprint: C0402; Value: 1u
C93 = CAP NP: Part Reference: C93; PCB Footprint: C0402; Value: 1u
C94 = CAP NP: Part Reference: C94; PCB Footprint: C0402; Value: 0.1u
C95 = CAP NP: Part Reference: C95; PCB Footprint: C0402; Value: 1u
C96 = C_Dup1: Part Reference: C96; PCB Footprint: C0603; Value: 10u
C97 = C_Dup1: Part Reference: C97; PCB Footprint: C0603; Value: 10u
C98 = CAP NP: Part Reference: C98; PCB Footprint: C0402; Value: 0.1u
C99 = CAP_NP_Dup1: Part Reference: C99; CLASS: DISCRETE; PCB Footprint: C0402; Value: 0.1u
C100 = CAP_NP_Dup1: Part Reference: C100; CLASS: DISCRETE; Value: 10u; PCB Footprint: C0603
C101 = CAP_NP_Dup1: Part Reference: C101; CLASS: DISCRETE; PCB Footprint: C0402; Value: 0.1u
C102 = CAP_NP_Dup1: Part Reference: C102; CLASS: DISCRETE; PCB Footprint: C0402; Value: 0.1u
C103 = CAP_NP_Dup1: Part Reference: C103; CLASS: DISCRETE; PCB Footprint: C0402; Value: 0.1u
C104 = CAP_NP_Dup1: Part Reference: C104; CLASS: DISCRETE; PCB Footprint: C0402; Value: 0.1u
C105 = CAP_NP_Dup1: Part Reference: C105; CLASS: DISCRETE; Value: 10u; PCB Footprint: C0603
C106 = CAP_NP_Dup1: Part Reference: C106; CLASS: DISCRETE; PCB Footprint: C0402; Value: 0.1u
C107 = CAP_NP_Dup1: Part Reference: C107; CLASS: DISCRETE; PCB Footprint: C0402; Value: 0.1u
C108 = CAP_NP_Dup1: Part Reference: C108; CLASS: DISCRETE; PCB Footprint: C0402; Value: 22p
C109 = CAP_NP_Dup1: Part Reference: C109; CLASS: DISCRETE; PCB Footprint: C0402; Value: 22p
C110 = CAP_NP_Dup1: Part Reference: C110; CLASS: DISCRETE; PCB Footprint: C0402; Value: 0.1u
C111 = CAP_NP: CAP CER 0.01UF 10V 10% X5R 0201; Part Reference: C111; CLASS: DISCRETE; AGILE_PN: 150-76650; MFG_NAME01: PANASONIC; MFG_PN01: ECJ-ZEB1A103K; CAD_APPROVED: YES; FPLIST: CC0201,CC0201_HD,0201_CC; Value: 0.1u; Tolerance: 10%; TOL: 10%; ROHS: YES; HEIGHT: 0.33mm; PCB Footprint: C0402
C112 = CAP_NP: CAP CER 0.01UF 10V 10% X5R 0201; Part Reference: C112; CLASS: DISCRETE; FPLIST: CC0201,CC0201_HD,0201_CC; CAD_APPROVED: YES; MFG_PN01: ECJ-ZEB1A103K; MFG_NAME01: PANASONIC; AGILE_PN: 150-76650; Value: 1u; PCB Footprint: C0402; HEIGHT: 0.33mm; ROHS: YES; TOL: 10%; Tolerance: 10%
C113 = CAP_NP: CAP CER 0.01UF 10V 10% X5R 0201; Part Reference: C113; CLASS: DISCRETE; FPLIST: CC0201,CC0201_HD,0201_CC; CAD_APPROVED: YES; MFG_PN01: ECJ-ZEB1A103K; MFG_NAME01: PANASONIC; AGILE_PN: 150-76650; Value: 0.1u; PCB Footprint: C0402; HEIGHT: 0.33mm; ROHS: YES; TOL: 10%; Tolerance: 10%
C114 = CAP_NP: CAP CER 0.01UF 10V 10% X5R 0201; Part Reference: C114; CLASS: DISCRETE; FPLIST: CC0201,CC0201_HD,0201_CC; CAD_APPROVED: YES; MFG_PN01: ECJ-ZEB1A103K; MFG_NAME01: PANASONIC; AGILE_PN: 150-76650; Value: 0.1u; PCB Footprint: C0402; HEIGHT: 0.33mm; ROHS: YES; TOL: 10%; Tolerance: 10%
C115 = C_Dup1: Part Reference: C115; PCB Footprint: C0603; Value: 10u
C116 = CAP NP_Dup3: Part Reference: C116; 1ST PART DESCRIPTION: CAP 10uF X7R 16V 20%; OriginalSymbolOrigin: (0,0); Pin Numbers Visible: False; Pin Names Rotate: True; Value: 22p; Pin Names Visible: False; PCB Footprint: C0402
C117 = CAP NP_Dup3: Part Reference: C117; 1ST PART DESCRIPTION: CAP 10uF X7R 16V 20%; OriginalSymbolOrigin: (0,0); Pin Names Rotate: True; Pin Names Visible: False; Value: 22p; Pin Numbers Visible: False; PCB Footprint: C0402
C118 = CAP NP: Part Reference: C118; PCB Footprint: C0402; Value: 0.1u
C119 = C_Dup1: Part Reference: C119; PCB Footprint: C0402; Value: 2.2u
C120 = CAP NP: Part Reference: C120; PCB Footprint: C1206; Value: 10n1KV
C121 = C_Dup1: Part Reference: C121; PCB Footprint: C0402; Value: 2.2u
C122 = C_Dup1: Part Reference: C122; PCB Footprint: C0805; Value: 22u
C123 = CAP NP_Dup3: Part Reference: C123; 1ST PART DESCRIPTION: CAP 10uF X7R 16V 20%; OriginalSymbolOrigin: (0,0); Pin Numbers Visible: False; Pin Names Rotate: True; Value: 0.1u; Pin Names Visible: False; PCB Footprint: C0402
C124 = C_Dup1: Part Reference: C124; PCB Footprint: C0805; Value: 22u
C125 = C_Dup1: Part Reference: C125; PCB Footprint: C0805; Value: 22u
C126 = CAP_NP: CAP CER 0.01UF 10V 10% X5R 0201; Part Reference: C126; CLASS: DISCRETE; AGILE_PN: 150-76650; MFG_NAME01: PANASONIC; MFG_PN01: ECJ-ZEB1A103K; CAD_APPROVED: Yes; FPLIST: CC0201,CC0201_HD,0201_CC; Value: 22p; Tolerance: 10%; TOL: 10%; ROHS: Yes; HEIGHT: 0.33mm; PCB Footprint: C0402
C127 = CAP_NP: CAP CER 0.01UF 10V 10% X5R 0201; Part Reference: C127; CLASS: DISCRETE; AGILE_PN: 150-76650; MFG_NAME01: PANASONIC; MFG_PN01: ECJ-ZEB1A103K; CAD_APPROVED: Yes; FPLIST: CC0201,CC0201_HD,0201_CC; Value: 22p; Tolerance: 10%; TOL: 10%; ROHS: Yes; HEIGHT: 0.33mm; PCB Footprint: C0402
C128 = CAP_NP: CAP CER 0.01UF 10V 10% X5R 0201; Part Reference: C128; CLASS: DISCRETE; FPLIST: CC0201,CC0201_HD,0201_CC; CAD_APPROVED: Yes; MFG_PN01: ECJ-ZEB1A103K; MFG_NAME01: PANASONIC; AGILE_PN: 150-76650; Value: 0.1u; PCB Footprint: C0402; HEIGHT: 0.33mm; ROHS: Yes; TOL: 10%; Tolerance: 10%
C129 = CAP_NP: CAP CER 0.01UF 10V 10% X5R 0201; Part Reference: C129; CLASS: DISCRETE; FPLIST: CC0201,CC0201_HD,0201_CC; CAD_APPROVED: Yes; MFG_PN01: ECJ-ZEB1A103K; MFG_NAME01: PANASONIC; AGILE_PN: 150-76650; Value: 0.1u; PCB Footprint: C0402; HEIGHT: 0.33mm; ROHS: Yes; TOL: 10%; Tolerance: 10%
C130 = CAP NP_Dup3: Part Reference: C130; 1ST PART DESCRIPTION: CAP 10uF X7R 16V 20%; OriginalSymbolOrigin: (0,0); Pin Numbers Visible: False; Pin Names Rotate: True; Value: 0.1u; Pin Names Visible: False; PCB Footprint: C0402
C131 = CAP NP_Dup3: Part Reference: C131; 1ST PART DESCRIPTION: CAP 10uF X7R 16V 20%; OriginalSymbolOrigin: (0,0); Pin Numbers Visible: False; Pin Names Rotate: True; Value: NC; PCB Footprint: C0402; Pin Names Visible: False
C132 = CAP NP_Dup1: Part Reference: C132; Assembly: C0603; Value: 1n; PCB Footprint: C0402
C177 = CAP NP_3: Part Reference: C177; CLASS: DISCRETE; PCB Footprint: C0402; Value: 2.2u
CON1 = USB_A_DUAR: Part Reference: CON1; Value: USB_A_DUAR; PCB Footprint: USB_A_DUAL
CON2 = CON40_LCD: Part Reference: CON2; Value: CON40_LCD; PCB Footprint: LCD-FPC-40-0P5-90-REV
CON3 = USB_A_DUAR: Part Reference: CON3; Value: USB_A_DUAR; PCB Footprint: USB_A_DUAL
CON4 = CON40_LCD: Part Reference: CON4; Value: CON40_LCD; PCB Footprint: LCD-FPC-40-0P5-90
D1 = DIODE: Part Reference: D1; PCB Footprint: SOD323; Value: B5819WS
D2 = DIODE_Dup1: Part Reference: D2; PCB Footprint: SOD123; Value: B5819W
D3 = DIODE: Part Reference: D3; PCB Footprint: SOD323; Value: B5819WS
D4 = DIODE: Part Reference: D4; PCB Footprint: SOD323; Value: B5819WS
D5 = DIODE TVS Dur: Part Reference: D5; Value: SMBJ5.0CA; PCB Footprint: SMB
D6 = DIODE ZENER1: Part Reference: D6; Value: MM1Z3V9; PCB Footprint: SOD123
D7 = DIODE: Part Reference: D7; PCB Footprint: SOD323; Value: B5819WS
D8 = DIODE TVS Dur: Part Reference: D8; Value: ESD0402; PCB Footprint: ESD0402
D9 = LED0603: Part Reference: D9; Value: RED; PCB Footprint: LED0603
D10 = DIODE ZENER1: Part Reference: D10; Value: B5819W; PCB Footprint: SOD123
D15 = BAV99: Part Reference: D15; Value: BAV99; PCB Footprint: SOT23
D16 = DIODE ZENER1: Part Reference: D16; Value: MM1Z7V5; PCB Footprint: SOD123
D17 = BAV99: Part Reference: D17; Value: BAV99; PCB Footprint: SOT23
D18 = DIODE ZENER1: Part Reference: D18; Value: MM1Z16; PCB Footprint: SOD123
D19 = DIODE_Dup1: Part Reference: D19; PCB Footprint: SOD123; Value: B5819W
D51 = LED0603: Part Reference: D51; Value: RED; PCB Footprint: LED0603
FB1 = BEED_Dup1: Part Reference: FB1; PCB Footprint: L0402; Value: 600R
FB2 = BEED_Dup1: Part Reference: FB2; PCB Footprint: L0402; Value: 600R
FB3 = BEED_Dup1: Part Reference: FB3; PCB Footprint: L0402; Value: 600R
FB4 = BEED_Dup1: Part Reference: FB4; PCB Footprint: L0402; Value: 600R
FB5 = BEED_Dup1: Part Reference: FB5; PCB Footprint: L0402; Value: 600R
FB6 = BEED_Dup1: Part Reference: FB6; PCB Footprint: L0402; Value: 600R
FB10 = BEED: Part Reference: FB10; PCB Footprint: L0402; Value: 600R
H1 = HOLE: Part Reference: H1; PCB Footprint: HOLE_M2.5/5.5_NOPAD; Value: HOLE
H2 = HOLE: Part Reference: H2; PCB Footprint: HOLE_M2.5/5.5_NOPAD; Value: HOLE
H3 = HOLE: Part Reference: H3; PCB Footprint: HOLE_M2.5/5.5_NOPAD; Value: HOLE
H4 = HOLE: Part Reference: H4; PCB Footprint: HOLE_M2.5/5.5_NOPAD; Value: HOLE
J1 = TFCARD_DEC: Part Reference: J1; PCB Footprint: TF2; Value: TFCARD_DEC
J4 = CON6: Part Reference: J4; Value: CON6; PCB Footprint: LCD-FPC-6-0P5-90-REV
J5 = MIC: Part Reference: J5; PCB Footprint: MIC-4013-1-SMT; Value: MIC
J7 = ANT_IPX: Part Reference: J7; Value: ANT_IPX; PCB Footprint: ANT_IPX
J8 = PHONEJACK_PJ-312: Part Reference: J8; Value: PHONEJACK_PJ-312; PCB Footprint: PHONEJACK_PJ-312_DIP
J9 = USB_TYPEC_6P: Part Reference: J9; Value: USB_TYPEC_6P; PCB Footprint: USB_TYPEC_6P
J14 = RJ45_LED_1000M: Part Reference: J14; Value: RJ45_LED_1000M; PCB Footprint: HR911130A
J15 = CON50_LCD: Part Reference: J15; Value: AT070TN92; PCB Footprint: LCD-FPC-50-0P5-90
J16 = CON20x2: Part Reference: J16; Value: CON20x2; PCB Footprint: CON20X2.54MM
L1 = Inductor_Dup1: Part Reference: L1; PCB Footprint: L2520; Value: WIP252012P-2R2ML
L2 = Inductor: Part Reference: L2; Package: L-3; Value: WIP252012P-4R7ML
L3 = Inductor_Dup2: Part Reference: L3; PCB Footprint: L2520; Value: WIP252012P-4R7ML
L4 = Inductor_Dup1: Part Reference: L4; PCB Footprint: L2520; Value: WIP252012P-2R2ML
L5 = Inductor_Dup1: Part Reference: L5; PCB Footprint: L2520; Value: WIP252012P-2R2ML
L6 = Inductor: Part Reference: L6; PCB Footprint: L0603; Package: L-3; Value: CPY160808T-2R2M-NP
L7 = Inductor: Part Reference: L7; PCB Footprint: L0402; Value: 8.2uH
L8 = Inductor: Part Reference: L8; PCB Footprint: L0402; Value: 8.2uH
R1 = R_0: Part Reference: R1; PCB Footprint: R0402; Value: 10K
R2 = R_Dup1: Part Reference: R2; PCB Footprint: R0402; Value: 100K
R3 = R_Dup1: Part Reference: R3; PCB Footprint: R0402; Value: 100K
R4 = R_Dup1: Part Reference: R4; PCB Footprint: R0402; Value: 200K
R5 = R_0: Part Reference: R5; PCB Footprint: R0402; Value: 1K
R6 = R_0: Part Reference: R6; PCB Footprint: R0402; Value: 100K
R7 = RES_0: RES MF 47K 1/10W 5% 0603; Part Reference: R7; AGILE_PN: 470-75849; MFG_NAME01: VENKEL COMPANY; MFG_PN01: CR0603-10W-473JT; CAD_APPROVED: YES; FPLIST: RC0603_OV,RC0603,0603_CC; Value: 10K; Tolerance: 5%; ROHS: YES; PCB Footprint: R0402
R8 = R_0: Part Reference: R8; PCB Footprint: R0402; Value: 100K
R9 = R_0: Part Reference: R9; Value: NC; PCB Footprint: R0603
R10 = R_0: Part Reference: R10; PCB Footprint: R0402; Value: 680K
R11 = R: Part Reference: R11; PCB Footprint: R0402; Value: 33R
R12 = R_0: Part Reference: R12; PCB Footprint: R0402; Value: 0R
R13 = R_Dup2: Part Reference: R13; PCB Footprint: R0402; Value: 33R
R14 = R_0: Part Reference: R14; PCB Footprint: R0402; Value: 2K
R15 = R_Dup1: Part Reference: R15; Value: 100K
R16 = R_Dup1: Part Reference: R16; PCB Footprint: R0402; Value: 100K
R17 = R_Dup1: Part Reference: R17; PCB Footprint: R0402; Value: 200K
R18 = R_Dup1: Part Reference: R18; PCB Footprint: R0402; Value: 100K
R19 = R_0: Part Reference: R19; PCB Footprint: R0402; Value: 4.7K
R20 = R_Dup1: Part Reference: R20; PCB Footprint: R0402; Value: 22K
R21 = R_Dup1: Part Reference: R21; PCB Footprint: R0402; Value: 150K
R22 = R_Dup1: Part Reference: R22; PCB Footprint: R0402; Value: 100K
R23 = R: Part Reference: R23; PCB Footprint: R0402; Value: 33R
R24 = R_0: Part Reference: R24; PCB Footprint: R0402; Value: 1K
R25 = R_0: Part Reference: R25; PCB Footprint: R0402; Value: 2K
R26 = R_0: Part Reference: R26; PCB Footprint: R0402; Value: 200K
R27 = R_0: Part Reference: R27; PCB Footprint: R0402; Value: 1K
R28 = R_0: Part Reference: R28; PCB Footprint: R0402; Value: 10K
R29 = R: Part Reference: R29; PCB Footprint: R0402; Value: 240R
R30 = R_0: Part Reference: R30; PCB Footprint: R0402; Value: 27K
R31 = R_0: Part Reference: R31; Value: 1.5R; PCB Footprint: R0603
R32 = R_0: Part Reference: R32; PCB Footprint: R0402; Value: 22K
R33 = R_0: Part Reference: R33; PCB Footprint: R0402; Value: 10K
R34 = R: Part Reference: R34; PCB Footprint: R0402; Value: 0R
R35 = R: Part Reference: R35; PCB Footprint: R0402; Value: 1K
R36 = R: Part Reference: R36; PCB Footprint: R0402; Value: 0R
R37 = R: Part Reference: R37; PCB Footprint: R0402; Value: 33R
R38 = R_0: Part Reference: R38; PCB Footprint: R0402; Value: 10K
R39 = R_Dup2: Part Reference: R39; PCB Footprint: R0402; Value: 4.7K
R40 = R_0: Part Reference: R40; PCB Footprint: R0402; Value: 10K
R41 = R: Part Reference: R41; PCB Footprint: R0402; Value: 10K
R42 = R: Part Reference: R42; PCB Footprint: R0402; Value: 10K
R43 = R_0: Part Reference: R43; PCB Footprint: R0402; Value: 10K
R44 = R_0: Part Reference: R44; PCB Footprint: R0402; Value: 10K
R45 = R_0: Part Reference: R45; PCB Footprint: R0402; Value: 0R
R46 = R_Dup2: Part Reference: R46; PCB Footprint: R0402; Value: 4.7K
R47 = R_Dup2: Part Reference: R47; PCB Footprint: R0402; Value: 2.49K
R48 = R_Dup2: Part Reference: R48; PCB Footprint: R0402; Value: 33R
R49 = R_Dup2: Part Reference: R49; PCB Footprint: R0402; Value: 470R
R50 = R_Dup2: Part Reference: R50; PCB Footprint: R0402; Value: 470R
R51 = R_0: Part Reference: R51; PCB Footprint: R0402; Value: 5.1K
R52 = R_0: Part Reference: R52; PCB Footprint: R0402; Value: 5.1K
R53 = R_Dup2: Part Reference: R53; PCB Footprint: R0402; Value: 33R
R56 = R: Part Reference: R56; PCB Footprint: R0402; Value: 33R
R57 = R: Part Reference: R57; PCB Footprint: R0402; Value: 33R
R58 = R: Part Reference: R58; PCB Footprint: R0402; Value: 33R
R59 = R: Part Reference: R59; PCB Footprint: R1206; Value: 1M
R60 = R_0: Part Reference: R60; PCB Footprint: R0402; Value: 3.4K
R66 = R: Part Reference: R66; PCB Footprint: R0402; Value: 1K
R67 = R: Part Reference: R67; PCB Footprint: R0402; Value: 1K
R68 = R: Part Reference: R68; PCB Footprint: R0402; Value: 75R
R69 = R: Part Reference: R69; PCB Footprint: R0402; Value: 100K
R70 = R: Part Reference: R70; Value: 75R; PCB Footprint: R0603
R71 = R: Part Reference: R71; Value: 75R; PCB Footprint: R0603
R72 = R: Part Reference: R72; Value: 75R; PCB Footprint: R0603
R73 = R_Dup2: Part Reference: R73; PCB Footprint: R0402; Value: 10K
R74 = R_0: Part Reference: R74; PCB Footprint: R0402; Value: 10K
R75 = R_0: Part Reference: R75; PCB Footprint: R0402; Value: 10K
R76 = R_0: Part Reference: R76; PCB Footprint: R0402; Value: 10K
R79 = R: Part Reference: R79; PCB Footprint: R0402; Value: 330R
R80 = R: Part Reference: R80; PCB Footprint: R0402; Value: 330R
R101 = R_0: Part Reference: R101; PCB Footprint: R0402; Value: 1K
R107 = R_0: Part Reference: R107; PCB Footprint: R0402; Value: 10K
SW1 = SW_PUSHBUTTON: Part Reference: SW1; PCB Footprint: KEY_3X3_4P_SMT; Value: KEY
SW2 = SW_PUSHBUTTON: Part Reference: SW2; PCB Footprint: KEY_3X3_4P_SMT; Value: KEY
U1 = MT3540: Part Reference: U1; Value: MT3540; PCB Footprint: SOT23-5
U2 = RTL8211F: Part Reference: U2; Value: RTL8211F; PCB Footprint: QFN40_GNDPAD
U3 = SY7200AABC: Part Reference: U3; Value: MT9284BS6; PCB Footprint: SOT23-6
U4 = BM9168: Part Reference: U4; Value: MD5118; PCB Footprint: SOT23
U5 = WIFI_AIC8800D80_USB: Part Reference: U5; Value: WIFI_AIC8800D80_USB; PCB Footprint: WIFI_AIC8800D80_USB
U6 = BM1707: Part Reference: U6; Value: MT3420B; PCB Footprint: SOT23-5
U7 = BM9168: Part Reference: U7; Value: LN6206P182MR-G; PCB Footprint: SOT23
U8 = CAT809J: Part Reference: U8; Value: CN803S; PCB Footprint: SOT23
U9 = BM1707: Part Reference: U9; Value: MT3420B; PCB Footprint: SOT23-5
U10 = T113: Part Reference: U10; Value: T113; PCB Footprint: LQFP128_0P4_16X16_EP
U11 = BM1707: Part Reference: U11; Value: MT3420B; PCB Footprint: SOT23-5
U12 = SL2.1S: Part Reference: U12; PCB Footprint: SSOP16_0P53; Value: SL2.1S
U13 = INDUCTOR 67144130_7: Part Reference: U13; Value: RClamp0524p; PCB Footprint: SPE6V8UD
U14 = INDUCTOR 67144130_7: Part Reference: U14; Value: RClamp0524p; PCB Footprint: SPE6V8UD
U15 = INDUCTOR 67144130_7: Part Reference: U15; Value: RClamp0524p; PCB Footprint: SPE6V8UD
U16 = INDUCTOR 67144130_7: Part Reference: U16; Value: RClamp0524p; PCB Footprint: SPE6V8UD
U17 = MT9700: Part Reference: U17; Value: MT9700; PCB Footprint: SOT23-5
U19 = TF_SMD: Part Reference: U19; PCB Footprint: LGA8_1P27_6X8; Value: SD_NAND
X1 = XTAL_SMD1: Part Reference: X1; PCB Footprint: XTAL_SMD_2520; Value: 24M_18p
X2 = XTAL_SMD1: Part Reference: X2; PCB Footprint: XTAL_SMD_2520; Value: 25MHz_18p
X3 = XTAL_SMD1: Part Reference: X3; PCB Footprint: XTAL_SMD_2520; Value: 12MHz_18p
Y1 = CRYSTAL1: Part Reference: Y1; PCB Footprint: XTAL_SMD_2012; Value: 32.768KHz_12.5p